# EAGLE design PX4IOv1.3 (EAGLE 6.2)
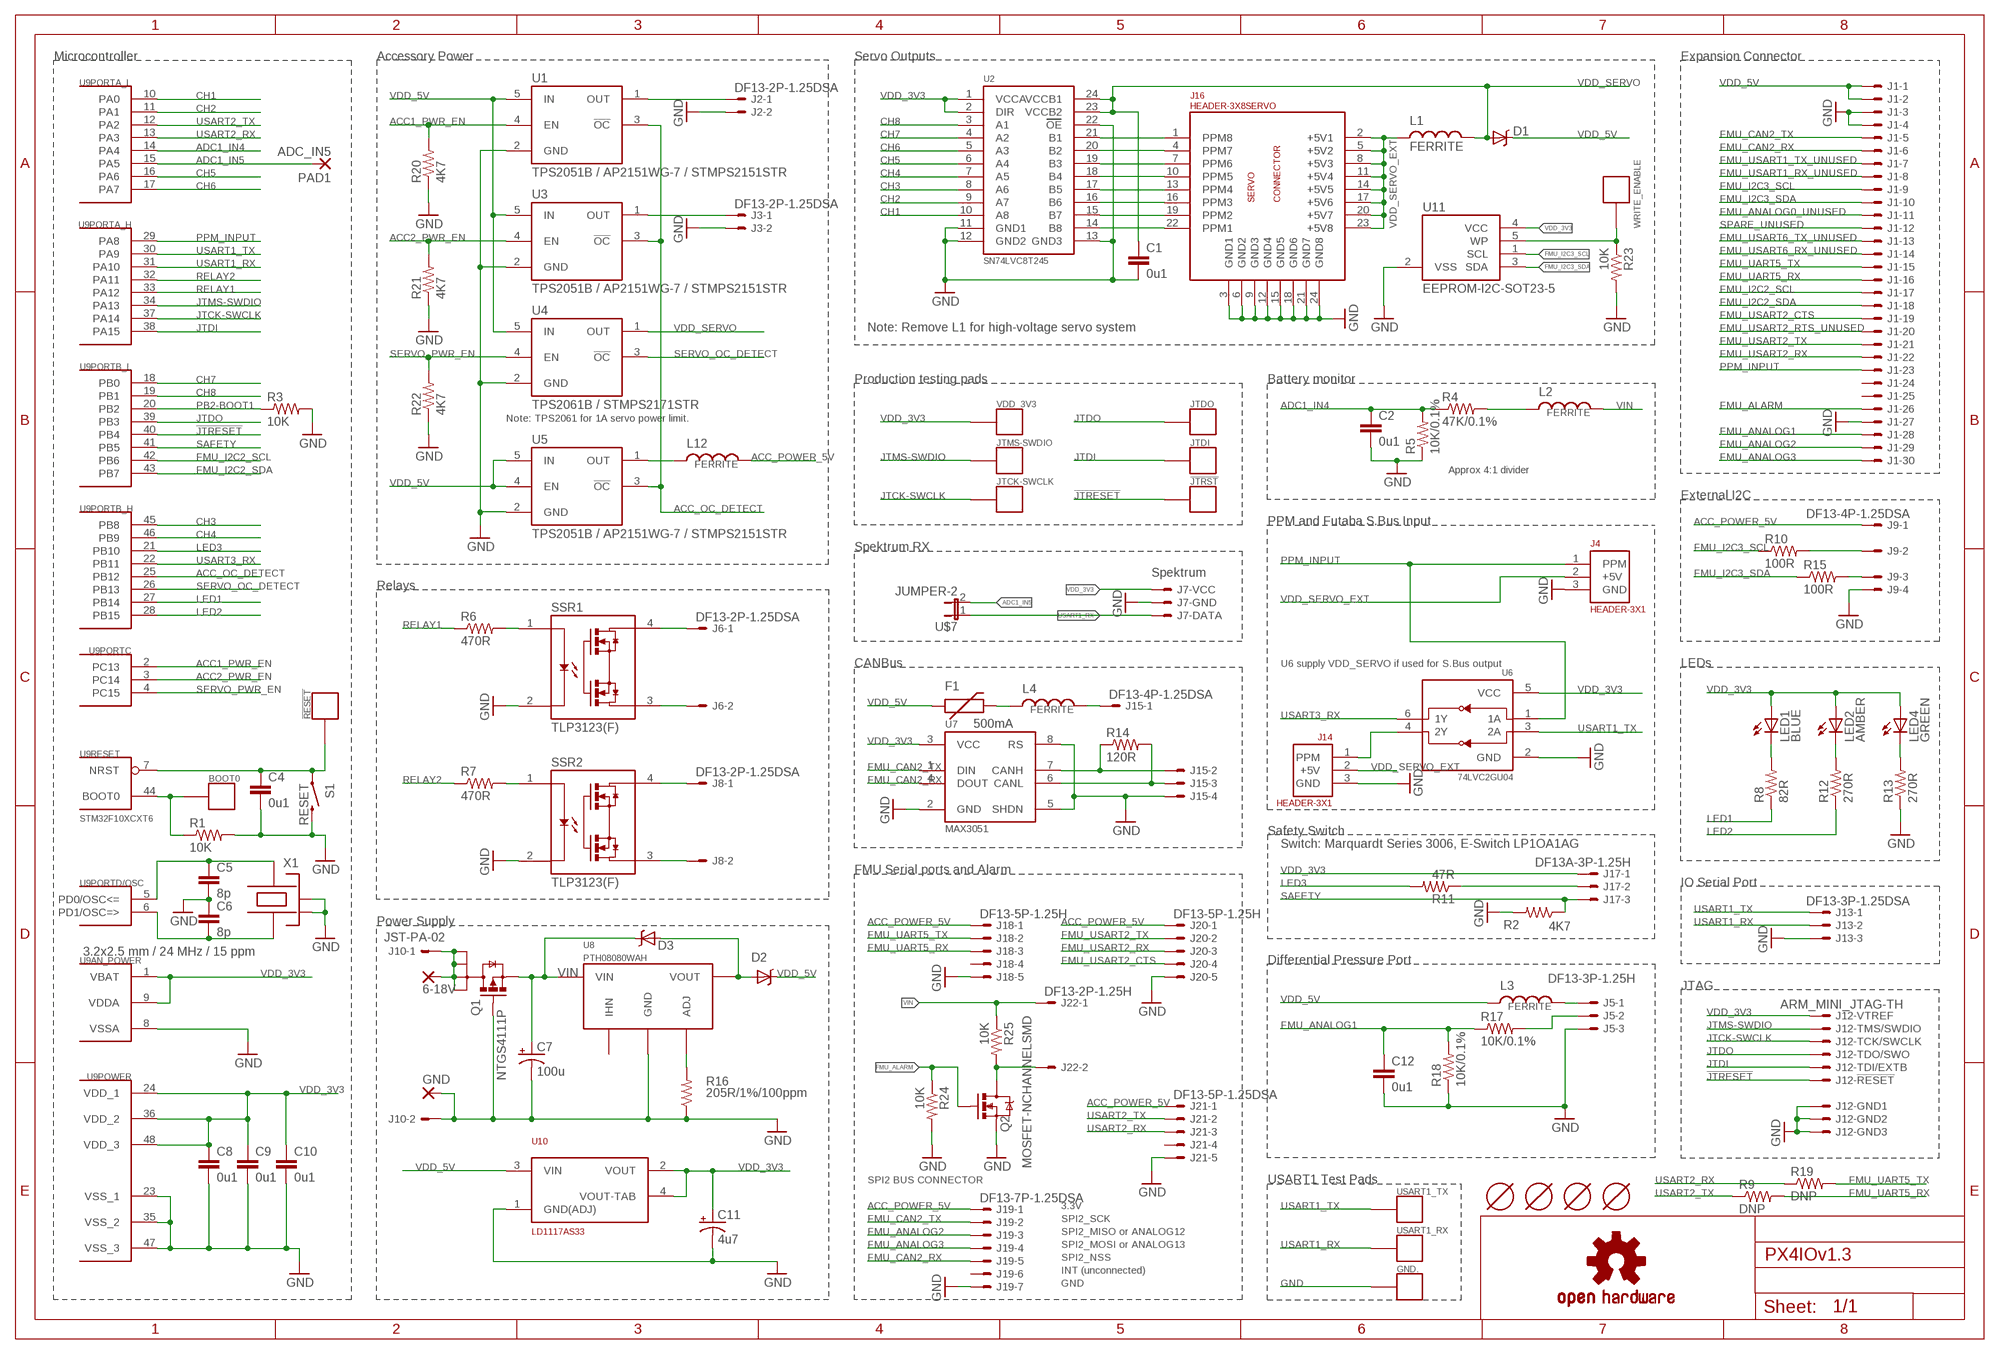
[diagram p0: schematic, sheet 1]

## Parts
6-18V  WIREPADSMD3,5-2  [3,5-2]
!JTRST  PAD.04  [PAD.04X.04]
!RESET  PAD.03  [PAD.03X.03]
BOOT0  PAD.04  [PAD.04X.04]
C1  0u1  CAP0402-CAP  [0402-CAP]
C2  0u1  CAP0402-CAP  [0402-CAP]
C4  0u1  CAP0402-CAP  [0402-CAP]
C5  8p  CAP0402-CAP  [0402-CAP]
C6  8p  CAP0402-CAP  [0402-CAP]
C7  100u  CAP_POL7343  [EIA7343]
C8  0u1  CAP0402-CAP  [0402-CAP]
C9  0u1  CAP0402-CAP  [0402-CAP]
C10  0u1  CAP0402-CAP  [0402-CAP]
C11  4u7  CAP_POL1206  [EIA3216]
C12  0u1  CAP0402-CAP  [0402-CAP]
D1  BAT 60A E6327  DIODE-SCHOTTKY_MSMP  [MICROSMP]
D2  BAT 60A E6327  DIODE-SCHOTTKY_MSMP  [MICROSMP]
D3  MSS1P4-M3/89A  DIODE-SCHOTTKY_MSMP  [MICROSMP]
F1  500mA  PTC0603  [0603]
GND  WIREPADSMD3,5-2  [3,5-2]
GND.  PAD.04  [PAD.04X.04]
J1  HEADER_2X15-REV  [HEADER_2MM_2X15_REVERSE]
J2  DF13-2P-1.25DSA  [DF13-2P-1.25DSA]
J3  DF13-2P-1.25DSA  [DF13-2P-1.25DSA]
J4  HEADER-3X1  HEADER-3X1RA  [3X1RA]
J5  DF13-3P-1.25H  [DF13A-3P-1.25H]
J6  DF13-2P-1.25DSA  [DF13-2P-1.25DSA]
J7  CONN_SPEKTRUM_RX-TH  [B3B-ZR]
J8  DF13-2P-1.25DSA  [DF13-2P-1.25DSA]
J9  DF13-4P-1.25DSA  [DF13-4P-1.25DSA]
J10  JST-PA-02  [S02B-PASK-2]
J12  ARM_MINI_JTAG-TH  [FTSH-105-01-XXX-DV]
J13  DF13-3P-1.25DSA  [DF13-3P-1.25DSA]
J14  HEADER-3X1  HEADER-3X1RA  [3X1RA]
J15  DF13-4P-1.25DSA  [DF13-4P-1.25DSA]
J16  HEADER-3X8SERVO  [3X8RA]
J17  DF13A-3P-1.25H  DF13-3P-1.25H  [DF13A-3P-1.25H]
J18  DF13-5P-1.25H  [DF13A-5P-1.25H]
J19  DF13-7P-1.25DSA  [DF13-7P-1.25DSA]
J20  DF13-5P-1.25H  [DF13A-5P-1.25H]
J21  DF13-5P-1.25DSA  [DF13-5P-1.25DSA]
J22  DF13-2P-1.25H  [DF13A-2P-1.25H]
JTCK-SWCLK  PAD.04  [PAD.04X.04]
JTDI  PAD.04  [PAD.04X.04]
JTDO  PAD.04  [PAD.04X.04]
JTMS-SWDIO  PAD.04  [PAD.04X.04]
L1  FERRITE  INDUCTOR0402  [0402-IND]
L2  FERRITE  INDUCTOR0402  [0402-IND]
L3  FERRITE  INDUCTOR0402  [0402-IND]
L4  FERRITE  INDUCTOR0402  [0402-IND]
L12  FERRITE  INDUCTOR0402  [0402-IND]
LED1  BLUE  LED0603  [LED-0603]
LED2  AMBER  LED0603  [LED-0603]
LED4  GREEN  LED0603  [LED-0603]
PAD1  ADC_IN5  WIREPADSMD2.5-1.8  [PAD-2.5-1.8]
Q1  NTGS4111P  [TSOP-6]
Q2  MOSFET-NCHANNELSMD  [SOT23-3]
R1  10K  RESISTOR0402-RES  [0402-RES]
R2  4K7  RESISTOR0402-RES  [0402-RES]
R3  10K  RESISTOR0402-RES  [0402-RES]
R4  47K/0.1%  RESISTOR0402-RES  [0402-RES]
R5  10K/0.1%  RESISTOR0402-RES  [0402-RES]
R6  470R  RESISTOR0402-RES  [0402-RES]
R7  470R  RESISTOR0402-RES  [0402-RES]
R8  82R  RESISTOR0402-RES  [0402-RES]
R9  DNP  RESISTOR0402-RES  [0402-RES]
R10  100R  RESISTOR0402-RES  [0402-RES]
R11  47R  RESISTOR0402-RES  [0402-RES]
R12  270R  RESISTOR0402-RES  [0402-RES]
R13  270R  RESISTOR0402-RES  [0402-RES]
R14  120R  RESISTOR0402-RES  [0402-RES]
R15  100R  RESISTOR0402-RES  [0402-RES]
R16  205R/1%/100ppm  RESISTOR0402-RES  [0402-RES]
R17  10K/0.1%  RESISTOR0402-RES  [0402-RES]
R18  10K/0.1%  RESISTOR0402-RES  [0402-RES]
R19  DNP  RESISTOR0402-RES  [0402-RES]
R20  4K7  RESISTOR0402-RES  [0402-RES]
R21  4K7  RESISTOR0402-RES  [0402-RES]
R22  4K7  RESISTOR0402-RES  [0402-RES]
R23  10K  RESISTOR0402-RES  [0402-RES]
R24  10K  RESISTOR0402-RES  [0402-RES]
R25  10K  RESISTOR0402-RES  [0402-RES]
S1  RESET  SWITCH-MOMENTARY-2  [EVQP7J01K]
SSR1  TLP3123(F)  TLP3123SO  [SOP4-2.54]
SSR2  TLP3123(F)  TLP3123SO  [SOP4-2.54]
U1  TPS2051B / AP2151WG-7 / STMPS2151STR  TPS2051B  [SOT23-5L]
U2  SN74LVC8T245  [R-PDSO-G24]
U3  TPS2051B / AP2151WG-7 / STMPS2151STR  TPS2051B  [SOT23-5L]
U4  TPS2061B / STMPS2171STR  TPS2051B  [SOT23-5L]
U5  TPS2051B / AP2151WG-7 / STMPS2151STR  TPS2051B  [SOT23-5L]
U6  74LVC2GU04  [SOT363_PHILIPS]
U7  MAX3051  [SO08]
U8  PTH08080WAH  [PTH08080W_TH]
U9  STM32F10XCXT6  [TQFP48]
U10  LD1117AS33  [SOT-223]
U11  EEPROM-I2C-SOT23-5  [SOT23-5]
U$1  OSHW-LOGOS  [OSHW-LOGO-S]
U$2  MOUNT-HOLE3.1MM  [MOUNT-HOLE3.1]
U$3  MOUNT-HOLE3.1MM  [MOUNT-HOLE3.1]
U$4  MOUNT-HOLE3.1MM  [MOUNT-HOLE3.1]
U$5  MOUNT-HOLE3.1MM  [MOUNT-HOLE3.1]
U$7  JUMPER-2  [SJ_2]
USART1_RX  PAD.04  [PAD.04X.04]
USART1_TX  PAD.04  [PAD.04X.04]
VDD_3V3  PAD.04  [PAD.04X.04]
WRITE_ENABLE  PAD.04  [PAD.04X.04]
X1  3.2x2.5 mm / 24 MHz / 15 ppm  OSCILLATOR-3.2X2.5  [OSCILLATOR-3.2X2.5]

## Nets
!JTRESET: !JTRST.P$1 J12.10 U9.40(PORTB_L:PB4)
ACC1_PWR_EN: R20.2 U1.4(EN) U9.2(PORTC:PC13)
ACC2_PWR_EN: R21.2 U3.4(EN) U9.3(PORTC:PC14)
ACC_OC_DETECT: U1.3(!OC) U3.3(!OC) U5.3(!OC) U9.25(PORTB_H:PB12)
ACC_POWER_5V [power]: J9.1 J18.1 J19.1 J20.1 J21.1 L12.2
ADC1_IN4: C2.1 R4.1 R5.2 U9.14(PORTA_L:PA4)
ADC1_IN5: PAD1.P$1(P) U9.15(PORTA_L:PA5) U$7.2
BOOT0: BOOT0.P$1 R1.1 U9.44(RESET:BOOT0)
CH1: U2.10(A8) U9.10(PORTA_L:PA0)
CH2: U2.9(A7) U9.11(PORTA_L:PA1)
CH3: U2.8(A6) U9.45(PORTB_H:PB8)
CH4: U2.7(A5) U9.46(PORTB_H:PB9)
CH5: U2.6(A4) U9.16(PORTA_L:PA6)
CH6: U2.5(A3) U9.17(PORTA_L:PA7)
CH7: U2.4(A2) U9.18(PORTB_L:PB0)
CH8: U2.3(A1) U9.19(PORTB_L:PB1)
FMU_ALARM: J1.26 Q2.1(G) R24.1
FMU_ANALOG0_UNUSED: J1.11
FMU_ANALOG1: C12.1 J1.28 R17.1 R18.2
FMU_ANALOG2: J1.29 J19.3
FMU_ANALOG3: J1.30 J19.4
FMU_CAN2_RX: J1.6 J19.5 U7.4(DOUT)
FMU_CAN2_TX: J1.5 J19.2 U7.1(DIN)
FMU_I2C2_SCL: J1.17 U9.42(PORTB_L:PB6)
FMU_I2C2_SDA: J1.18 U9.43(PORTB_L:PB7)
FMU_I2C3_SCL: J1.9 R10.1 U11.1(SCL)
FMU_I2C3_SDA: J1.10 R15.1 U11.3(SDA)
FMU_UART5_RX: J1.16 J18.3 R9.2
FMU_UART5_TX: J1.15 J18.2 R19.2
FMU_USART1_RX_UNUSED: J1.8
FMU_USART1_TX_UNUSED: J1.7
FMU_USART2_CTS: J1.19 J20.4
FMU_USART2_RTS_UNUSED: J1.20
FMU_USART2_RX: J1.22 J20.3
FMU_USART2_TX: J1.21 J20.2
FMU_USART6_RX_UNUSED: J1.14
FMU_USART6_TX_UNUSED: J1.13
GND [power]: C1.2 C2.2 C4.2 C5.2 C6.1 C7.C(-) C8.2 C9.2 C10.2 C11.C(-) C12.2 GND.1(P) GND..P$1 J1.3 J1.4 J1.27 J2.2 J3.2 J4.3(GND) J5.3 J7.2 J9.4 J10.2 J12.3 J12.5 J12.9 J13.3 J14.3(GND) J15.4 J16.3(GND1) J16.6(GND2) J16.9(GND3) J16.12(GND4) J16.15(GND5) J16.18(GND6) J16.21(GND7) J16.24(GND8) J18.5 J19.7 J20.5 J21.5 Q1.3(G) Q2.2(S) R1.2 R2.2 R3.2 R5.1 R13.1 R16.1 R18.1 R20.1 R21.1 R22.1 R23.2 R24.2 S1.B3 SSR1.2 SSR2.2 U1.2(GND) U2.11(GND1) U2.12(GND2) U2.13(GND3) U2.22(OE) U3.2(GND) U4.2(GND) U5.2(GND) U6.2(GND) U7.2(GND) U7.5(SHDN) U7.8(RS) U8.2(GND) U9.8(AN_POWER:VSSA) U9.23(POWER:VSS_1) U9.35(POWER:VSS_2) U9.47(POWER:VSS_3) U10.1(GND(ADJ)) U11.2(VSS) X1.2(NC_2) X1.4(NC_4)
JTCK-SWCLK: J12.4 JTCK-SWCLK.P$1 U9.37(PORTA_H:PA14)
JTDI: J12.8 JTDI.P$1 U9.38(PORTA_H:PA15)
JTDO: J12.6 JTDO.P$1 U9.39(PORTB_L:PB3)
JTMS-SWDIO: J12.2 JTMS-SWDIO.P$1 U9.34(PORTA_H:PA13)
LED1: R8.1 U9.27(PORTB_H:PB14)
LED2: R12.1 U9.28(PORTB_H:PB15)
LED3: R11.2 U9.21(PORTB_H:PB10)
N$1: R7.2 SSR2.1
N$2: R6.2 SSR1.1
N$3: J14.1(PPM) U6.4(2Y)
N$4 [power]: L12.1 U5.1(OUT)
N$5: C6.2 U9.6(PORTD/OSC:PD1/OSC=>) X1.1
N$6: C5.1 U9.5(PORTD/OSC:PD0/OSC<=) X1.3
N$7: L2.1 R4.2
N$8: LED1.C R8.2
N$9: R16.2 U8.4(ADJ)
N$10: J17.2 R11.1
N$11: R23.1 U11.5(WP) WRITE_ENABLE.P$1
N$12: J22.2 Q2.3(D) R25.2
N$14: F1.2 L4.1
N$15: J5.2 R17.2
N$21 [power]: J8.1 SSR2.4
N$22 [power]: J8.2 SSR2.3
N$23 [power]: J6.2 SSR1.3
N$24 [power]: J6.1 SSR1.4
N$27: J9.3 R15.2
N$28: J9.2 R10.2
N$29 [power]: J2.1 U1.1(OUT)
N$30 [power]: J3.1 U3.1(OUT)
N$31: LED2.C R12.2
N$38: LED4.C R13.2
N$43: J15.2 R14.1 U7.7(CANH)
N$44: J15.3 R14.2 U7.6(CANL)
N$47 [power]: J15.1 L4.2
NRST: !RESET.P$1 C4.1 S1.A1 U9.7(RESET:NRST)
PB2-BOOT1: R3.1 U9.20(PORTB_L:PB2)
PPM1: J16.22(PPM1) U2.14(B8)
PPM2: J16.19(PPM2) U2.15(B7)
PPM3: J16.16(PPM3) U2.16(B6)
PPM4: J16.13(PPM4) U2.17(B5)
PPM5: J16.10(PPM5) U2.18(B4)
PPM6: J16.7(PPM6) U2.19(B3)
PPM7: J16.4(PPM7) U2.20(B2)
PPM8: J16.1(PPM8) U2.21(B1)
PPM_INPUT: J1.23 J4.1(PPM) U6.1(1A) U9.29(PORTA_H:PA8)
RELAY1: R6.1 U9.33(PORTA_H:PA12)
RELAY2: R7.1 U9.32(PORTA_H:PA11)
SAFETY: J17.3 R2.1 U9.41(PORTB_L:PB5)
SERVO_OC_DETECT: U4.3(!OC) U9.26(PORTB_H:PB13)
SERVO_PWR_EN: R22.2 U4.4(EN) U9.4(PORTC:PC15)
SPARE_UNUSED: J1.12
USART1_RX: J7.1 J13.2 U9.31(PORTA_H:PA10) U$7.1 USART1_RX.P$1
USART1_TX: J13.1 U6.3(2A) U9.30(PORTA_H:PA9) USART1_TX.P$1
USART2_RX: J21.3 R19.1 U9.13(PORTA_L:PA3)
USART2_TX: J21.2 R9.1 U9.12(PORTA_L:PA2)
USART3_RX: U6.6(1Y) U9.22(PORTB_H:PB11)
VDD_3V3 [power]: C8.1 C9.1 C10.1 C11.A(+) J7.3 J12.1 J17.1 LED1.A LED2.A LED4.A U2.1(VCCA) U2.2(DIR) U6.5(VCC) U7.3(VCC) U9.1(AN_POWER:VBAT) U9.9(AN_POWER:VDDA) U9.24(POWER:VDD_1) U9.36(POWER:VDD_2) U9.48(POWER:VDD_3) U10.2(VOUT) U10.4(VOUT-TAB) U11.4(VCC) VDD_3V3.P$1
VDD_5V [power]: D1.CATHODE(C) D2.CATHODE(C) F1.1 J1.1 J1.2 L3.1 U1.5(IN) U3.5(IN) U4.5(IN) U5.4(EN) U5.5(IN) U10.3(VIN)
VDD_5V_ANALOG [power]: J5.1 L3.2
VDD_SERVO [power]: C1.1 D1.ANODE(A) L1.2 U2.23(VCCB2) U2.24(VCCB1) U4.1(OUT)
VDD_SERVO_EXT [power]: J4.2(+5V) J14.2(+5V) J16.2(+5V1) J16.5(+5V2) J16.8(+5V3) J16.11(+5V4) J16.14(+5V5) J16.17(+5V6) J16.20(+5V7) J16.23(+5V8) L1.1
VIN [power]: C7.A(+) D3.CATHODE(C) J22.1 L2.2 Q1.4(S) R25.1 U8.1(VIN)
VIN_CONTACT [power]: 6-18V.1(P) J10.1 Q1.1(D) Q1.2(D1) Q1.5(D2) Q1.6(D3)
VOUT: D2.ANODE(A) D3.ANODE(A) U8.3(VOUT)
Unconnected: J1.24 J1.25 J18.4 J19.6 J21.4 U8.5(IHN)

## Notes on the sheet
- Microcontroller | Accessory Power | Servo Outputs | Expansion Connector
- Note: Remove L1 for high-voltage servo system
- Production testing pads | Battery monitor
- Note: TPS2061 for 1A servo power limit.
- Approx 4:1 divider
- External I2C
- PPM and Futaba S.Bus Input
- Spektrum RX
- Spektrum
- Relays
- CANBus | U6 supply VDD_SERVO if used for S.Bus output | LEDs
- Safety Switch
- Switch: Marquardt Series 3006, E-Switch LP1OA1AG
- FMU Serial ports and Alarm
- IO Serial Port
- Power Supply
- Differential Pressure Port
- JTAG
- SPI2 BUS CONNECTOR | USART1 Test Pads
- 3.3V
- SPI2_SCK
- SPI2_MISO or ANALOG12
- SPI2_MOSI or ANALOG13
- SPI2_NSS
- INT (unconnected)
- GND

## Library data of the parts
6-18V GND = pixhawk2:WIREPAD: Wire PAD connect wire on PCB; BOM: EXCLUDE; PARTNO: *
!JTRST !RESET BOOT0 GND. JTCK-SWCLK JTDI JTDO JTMS-SWDIO USART1_RX USART1_TX VDD_3V3 WRITE_ENABLE = pixhawk2:PAD: Test pad This footprint includes three classes: The actual test pads, a pogo-pin footprint to mount the pogo-pin as through-hole part and a hole footprint which allows the head of the pogo-pin to pass through (do NOT use the hole to mount the pogo-pin). In a typical test setup, the stack would consist of three PCBs: The actual PCB under testing with a test pad on the bottom, then a second PCB with the hole for the pogo-pin head where the PCB under testing is pressed on and a third PCB at 30 mm / 1.2" distance with the pogo-pin footprints. The pogo-pins are soldered to the last PCB. To create the stack, copy the board under testing and exchange the footprints - this way the correct positioning is ensured.; BOM: EXCLUDE; PARTNO: *
C1 C2 C4 C8-C10 C12 = pixhawk2:CAP: Capacitor Standard 0603 ceramic capacitor, and 0.1" leaded capacitor.; PARTNO: CC0402ZRY5V7BB104
C5 C6 = pixhawk2:CAP: Capacitor Standard 0603 ceramic capacitor, and 0.1" leaded capacitor.; PARTNO: C1005C0G1H080C
C7 = pixhawk2:CAP_POL: Capacitor Polarized These are standard SMD and PTH capacitors. Normally 10uF, 47uF, and 100uF in electrolytic and tantalum varieties. Always verify the external diameter of the through hole cap, it varies with capacity, voltage, and manufacturer. The EIA devices should be standard.; PARTNO: T491X107K025ZT
C11 = pixhawk2:CAP_POL: Capacitor Polarized These are standard SMD and PTH capacitors. Normally 10uF, 47uF, and 100uF in electrolytic and tantalum varieties. Always verify the external diameter of the through hole cap, it varies with capacity, voltage, and manufacturer. The EIA devices should be standard.; PARTNO: T491A475K010AT
D1 D2 = pixhawk2:DIODE-SCHOTTKY: Schottky barrier diode in DO214AC, e.g. Fairchild SS14.; PARTNO: BAT 60A E6327
D3 = pixhawk2:DIODE-SCHOTTKY: Schottky barrier diode in DO214AC, e.g. Fairchild SS14.; PARTNO: MSS1P4-M3/89A
F1 = pixhawk2:PTC: Resettable Fuse PTC Resettable Fuse. Spark Fun Electronics SKU : COM-08357; PARTNO: MF-FSMF050X-2
J1 = pixhawk2:HEADER_2X15: 2X15 header; PARTNO: 951230-2520-AR-PR
J2 J3 J6 J8 = pixhawk2:DF13-2P-1.25?; PARTNO: DF13-2P-1.25DSA
J4 J14 = pixhawk2:HEADER-3X1: Single row 0.1" servo header; BOM: EXCLUDE; PARTNO: 53047-02
J5 = pixhawk2:DF13-3P-1.25?; PARTNO: DF13-3P-1.25H(20)
J7 = pixhawk2:CONN_SPEKTRUM_RX: Spektrum RX connector; JST ZH series S3B-ZR-SM4A-TF; PARTNO: B3B-ZR
J9 J15 = pixhawk2:DF13-4P-1.25?; PARTNO: DF13-4P-1.25DSA
J10 = pixhawk2:JST-PA-02: JST PA Series http://www.jst-mfg.com/product/pdf/eng/ePA-F.pdf; PARTNO: S02B-PASK-2
J12 = pixhawk2:ARM_MINI_JTAG: CONNECTOR wire to board 1.25 mm (.049 inch) pitch header; PARTNO: M50-3900542
J13 = pixhawk2:DF13-3P-1.25?; PARTNO: DF13-3P-1.25DSA
J16 = pixhawk2:HEADER-3X8; BOM: EXCLUDE; PARTNO: *
J17 = pixhawk2:DF13-3P-1.25?; PARTNO: DF13A-3P-1.25H(20)
J18 J20 = pixhawk2:DF13-5P-1.25?; PARTNO: DF13A-5P-1.25H(20)
J19 = pixhawk2:DF13-7P-1.25?; PARTNO: DF13-7P-1.25DSA(20)
J21 = pixhawk2:DF13-5P-1.25?; PARTNO: DF13-5P-1.25DSA(20)
J22 = pixhawk2:DF13-2P-1.25?; PARTNO: DF13-2P-1.25H(20)
L1-L4 L12 = pixhawk2:INDUCTOR: Inductors Basic Inductor/Choke - 0603 and 1206. Footprints are not proven and vary greatly between part numbers.; PARTNO: BKP1005HS121-T
LED1 = pixhawk2:LED: LEDs Standard schematic elements and footprints for 5mm, 3mm, 1206, and 0603 sized LEDs. 5mm - Spark Fun Electronics SKU : COM-00529 (and others); PARTNO: LNJ937W8CRA
LED2 = pixhawk2:LED: LEDs Standard schematic elements and footprints for 5mm, 3mm, 1206, and 0603 sized LEDs. 5mm - Spark Fun Electronics SKU : COM-00529 (and others); PARTNO: LNJ437W84RA
LED4 = pixhawk2:LED: LEDs Standard schematic elements and footprints for 5mm, 3mm, 1206, and 0603 sized LEDs. 5mm - Spark Fun Electronics SKU : COM-00529 (and others); PARTNO: LNJ337W83RA
PAD1 = pixhawk2:WIREPAD: Wire PAD connect wire on PCB; BOM: EXCLUDE
Q1 = pixhawk2:NTGS4111P; PARTNO: NTGS4111P
Q2 = pixhawk2:MOSFET-NCHANNEL; PARTNO: ZXMS6004FFTA
R1 R3 R5 R17 R18 R23-R25 = pixhawk2:RESISTOR: Resistor Basic schematic elements and footprints for 0603, 1206, and PTH 1/10th watt (small) resistors.; PARTNO: RMCF0402FT10K0
R2 R20-R22 = pixhawk2:RESISTOR: Resistor Basic schematic elements and footprints for 0603, 1206, and PTH 1/10th watt (small) resistors.; PARTNO: RMCF0402JT4K70
R4 = pixhawk2:RESISTOR: Resistor Basic schematic elements and footprints for 0603, 1206, and PTH 1/10th watt (small) resistors.; PARTNO: RC0402FR-0747KL
R6 R7 = pixhawk2:RESISTOR: Resistor Basic schematic elements and footprints for 0603, 1206, and PTH 1/10th watt (small) resistors.; PARTNO: RMCF0402JT470R
R8 = pixhawk2:RESISTOR: Resistor Basic schematic elements and footprints for 0603, 1206, and PTH 1/10th watt (small) resistors.; PARTNO: MCR01MZPJ820
R9 R19 = pixhawk2:RESISTOR: Resistor Basic schematic elements and footprints for 0603, 1206, and PTH 1/10th watt (small) resistors.; BOM: EXCLUDE; PARTNO: RMCF0402FT10K0
R10 R15 = pixhawk2:RESISTOR: Resistor Basic schematic elements and footprints for 0603, 1206, and PTH 1/10th watt (small) resistors.; PARTNO: RMCF0402JT100R
R11 = pixhawk2:RESISTOR: Resistor Basic schematic elements and footprints for 0603, 1206, and PTH 1/10th watt (small) resistors.; PARTNO: RMCF0402JT47R0
R12 R13 = pixhawk2:RESISTOR: Resistor Basic schematic elements and footprints for 0603, 1206, and PTH 1/10th watt (small) resistors.; PARTNO: MCR01MZPJ271
R14 = pixhawk2:RESISTOR: Resistor Basic schematic elements and footprints for 0603, 1206, and PTH 1/10th watt (small) resistors.; PARTNO: P120JCT-ND
R16 = pixhawk2:RESISTOR: Resistor Basic schematic elements and footprints for 0603, 1206, and PTH 1/10th watt (small) resistors.; PARTNO: ERJ-2RKF2050X
S1 = pixhawk2:SWITCH-MOMENTARY-2; BOM: EXCLUDE; PARTNO: EVQP7J01K
SSR1 SSR2 = pixhawk2:TLP3123: TLP3123 Solid State Relay The TOSHIBA TLP3123 consists of a gallium arsenide infrared emitting diode optically coupled to a photo-MOS FET in a plastic SOP package. The TLP3123 is a bi-directional switch, which can replace mechanical relays in many applications. And its high on-state current maximum rating and low on-state resistance is suitable to control a power line. http://www.semicon.toshiba.co.jp/docs/datasheet/en/Opto/TLP3123_en_datasheet_071001.pdf; PARTNO: TLP3123(F)
U1 U3 U5 = pixhawk2:TPS2051B: CURRENT-LIMITED, POWER-DISTRIBUTION SWITCH The TPS204xB/TPS205xB power-distribution switches are intended for applications where heavy capacitive loads and short circuits are likely to be encountered. 500-mA continuous current, accurate Current Limit (0.75 A min, 1.25 A max), operating range: 2.7 V to 5.5 V. These devices incorporates 70-m? N-channel MOSFET power switches for power-distribution systems that require multiple power switches in a single package. Each switch is controlled by a logic enable input. Gate drive is provided by an internal charge pump designed to control the power-switch rise times and fall times to minimize current surges during switching. The charge pump requires no external components and allows operation from supplies as low as 2.7 V. http://focus.ti.com/lit/ds/symlink/tps2051b.pdf; PARTNO: AP2151WG-7
U2 = pixhawk2:SN74LVC8T245; PARTNO: SN74LVC8T245DBQR
U4 = pixhawk2:TPS2051B: CURRENT-LIMITED, POWER-DISTRIBUTION SWITCH The TPS204xB/TPS205xB power-distribution switches are intended for applications where heavy capacitive loads and short circuits are likely to be encountered. 500-mA continuous current, accurate Current Limit (0.75 A min, 1.25 A max), operating range: 2.7 V to 5.5 V. These devices incorporates 70-m? N-channel MOSFET power switches for power-distribution systems that require multiple power switches in a single package. Each switch is controlled by a logic enable input. Gate drive is provided by an internal charge pump designed to control the power-switch rise times and fall times to minimize current surges during switching. The charge pump requires no external components and allows operation from supplies as low as 2.7 V. http://focus.ti.com/lit/ds/symlink/tps2051b.pdf; PARTNO: STMPS2171STR
U6 = pixhawk2:74LVC2GU04: DUAL INVERTER GATE This dual inverter is designed for 1.65-V to 5.5-V VCC operation. The SN74LVC2GU04 contains two inverters with unbuffered outputs and performs the Boolean function Y = A. It is available from NXP and TI. http://www.nxp.com/documents/data_sheet/74LVC2GU04.pdf http://focus.ti.com/lit/ds/symlink/sn74lvc2gu04.pdf; PARTNO: 74LVC2GU04GW,125
U7 = pixhawk2:MAX3051: 3.3-V CAN TRANSCEIVER; PARTNO: MAX3051ESA+
U8 = pixhawk2:PTH08080W: 2.25-A, WIDE-INPUT ADJUSTABLE SWITCHING REGULATOR The input voltage range of the PTH08080W is from 4.5 V to 18 V, allowing operation from either a 5-V or 12-V input bus. Using state-of-the-art switched-mode power-conversion technology, the PTH08080W can step down to voltages as low as 0.9 V from a 5-V input bus, with less than 1 W of power dissipation. The output voltage can be adjusted to any voltage over the range, 0.9 V to 5.5 V, using a single external resistor. Operating features include an undervoltage lockout (UVLO), on/off inhibit, overcurrent protection, and overtemperature protection. http://focus.ti.com/lit/ds/symlink/pth08080w.pdf; PARTNO: PTH08080WAH
U9 = pixhawk2:STM32F10XCXT6: ST STM32F101/103 48pin LQFP; PARTNO: STM32F100C8T6B
U10 = pixhawk2:LD1117A: LD1117A LDO Datasheet: http://www.st.com/stonline/books/pdf/docs/7194.pdf; PARTNO: LD1117AS33
U11 = pixhawk2:EEPROM-I2C-?; PARTNO: 24LC01BT-I/OT
U$1 = pixhawk2:OSHW-LOGO: Open Source Hardware Logo This logo indicates the piece of hardware it is found on incorporates a OSHW license and/or adheres to the definition of open source hardware found here: http://freedomdefined.org/OSHW; BOM: EXCLUDE
U$2-U$5 = pixhawk2:MOUNT-HOLE; BOM: EXCLUDE; PARTNO: *
U$7 = pixhawk2:JUMPER-2; BOM: EXCLUDE
X1 = pixhawk2:OSCILLATOR: Crystal Oscillator in 3.2x2.5 SMD; PARTNO: NX3225SA-24.000000MHZ

## Net classes
0 signal: width 0.203 mm, drill 0.3 mm, clearance 0.203 mm
1 power: width 0.254 mm, drill 0.3 mm, clearance 0.203 mm

## Board
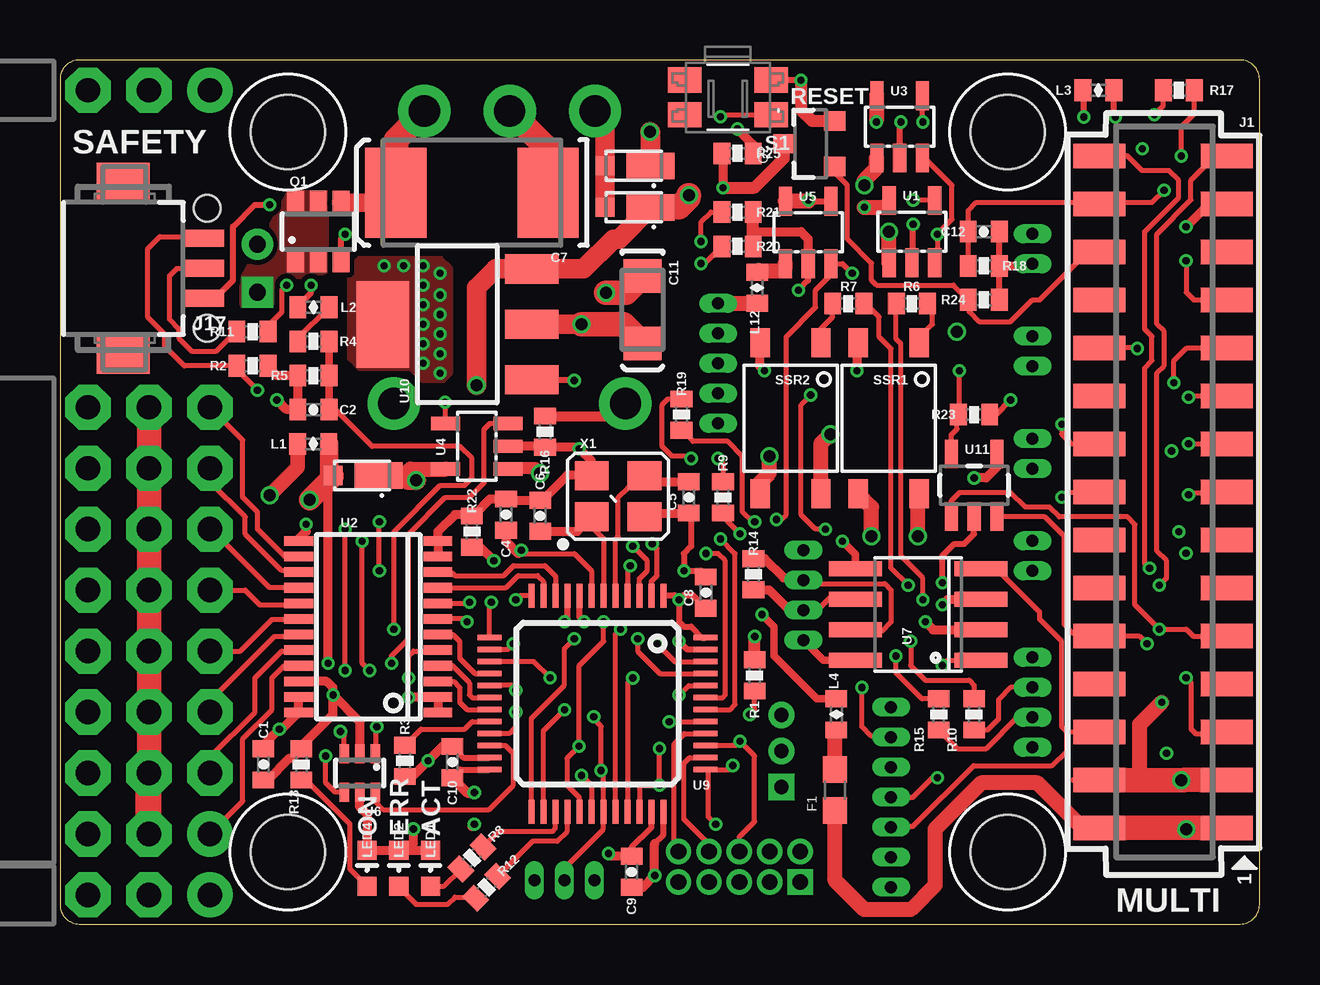
[diagram p1: board, top side]
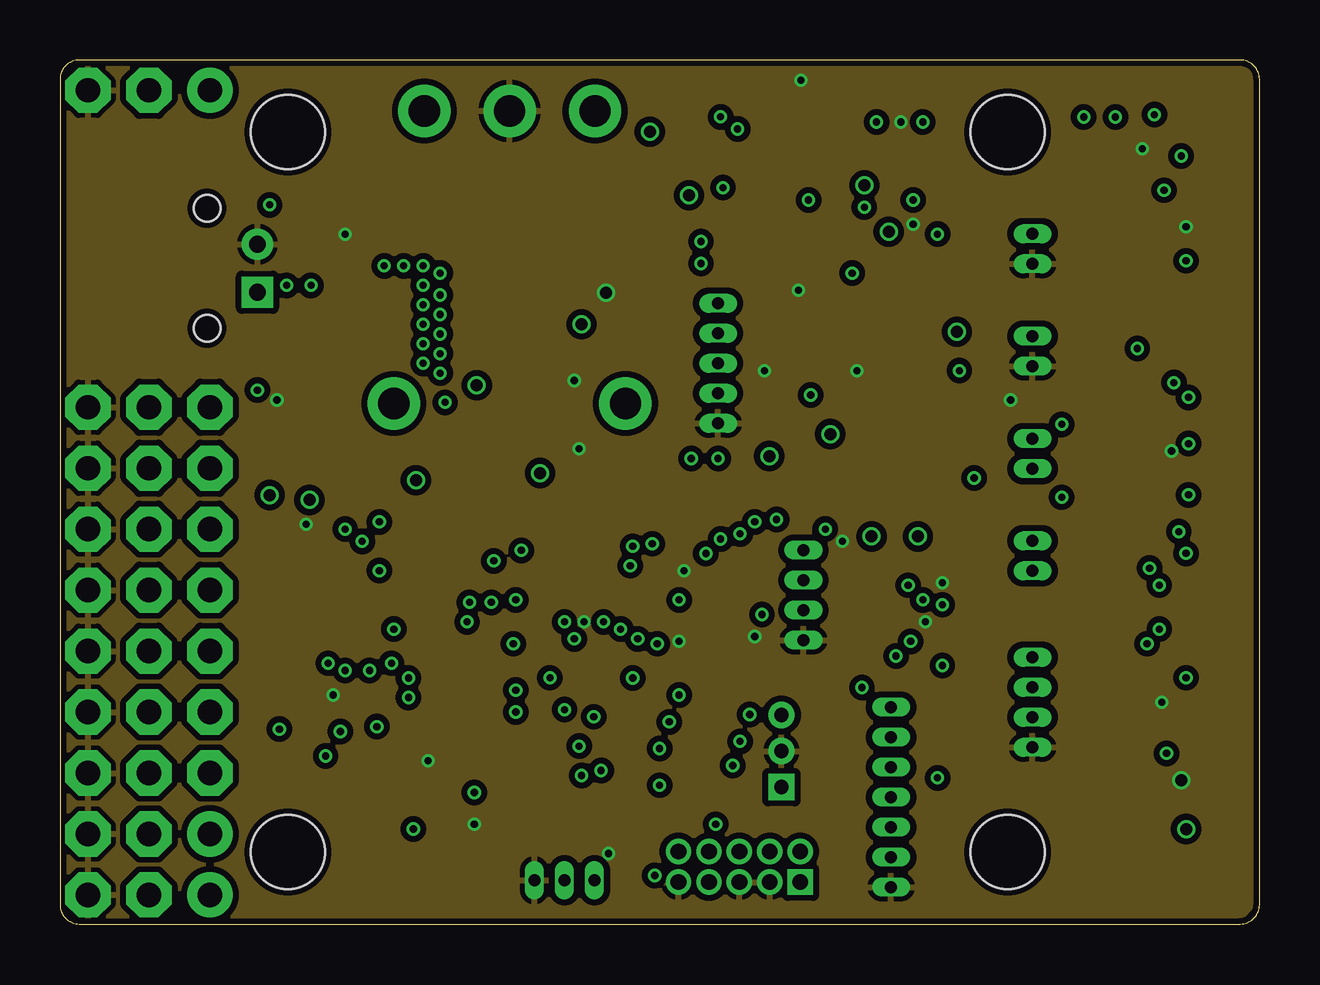
[diagram p2: board, inner layer Route2]
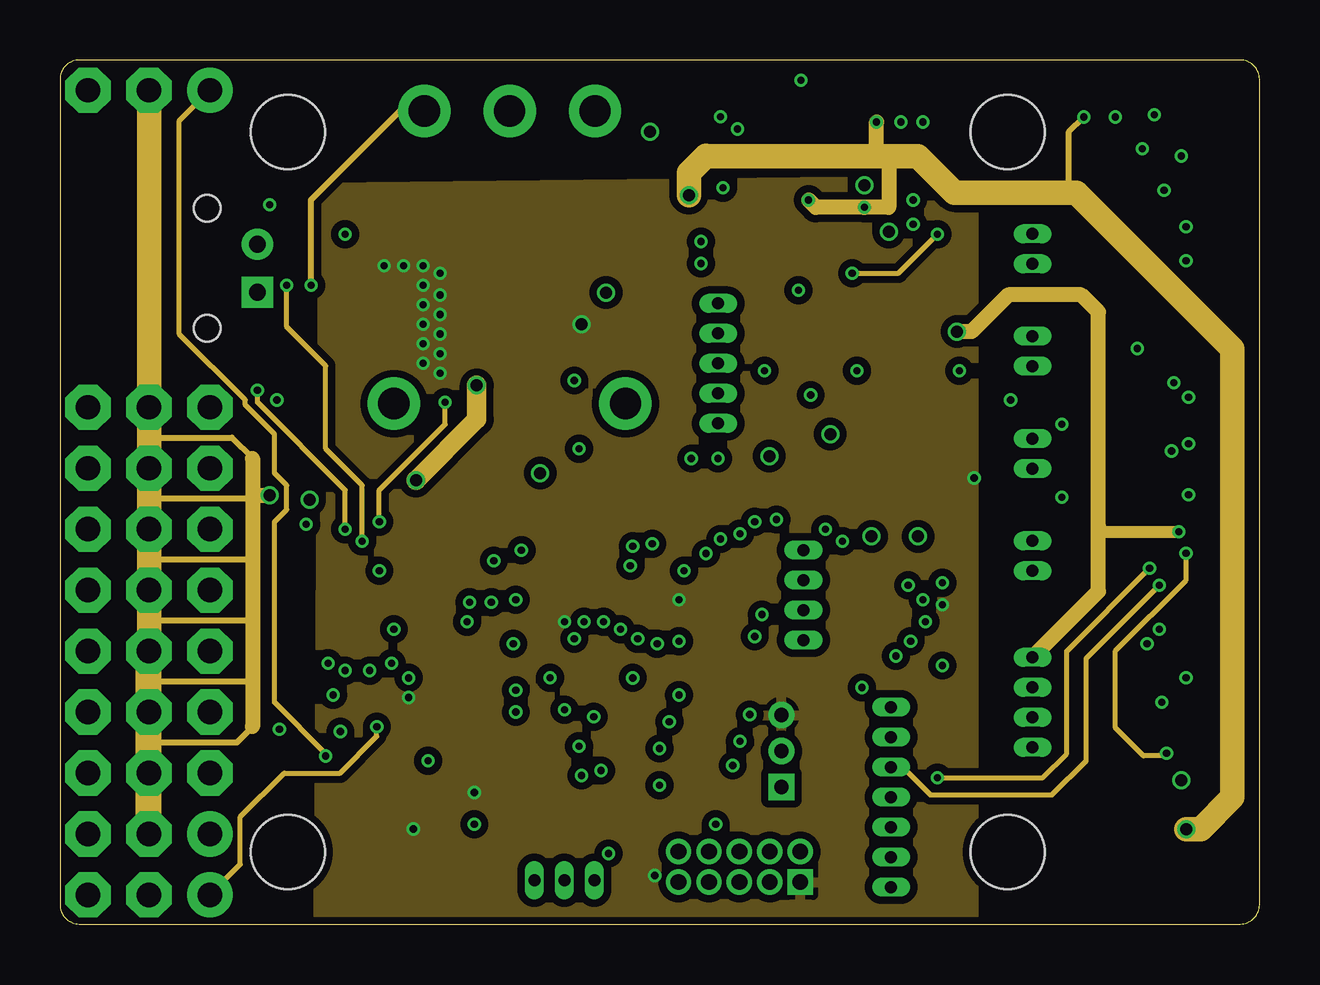
[diagram p3: board, inner layer Route15]
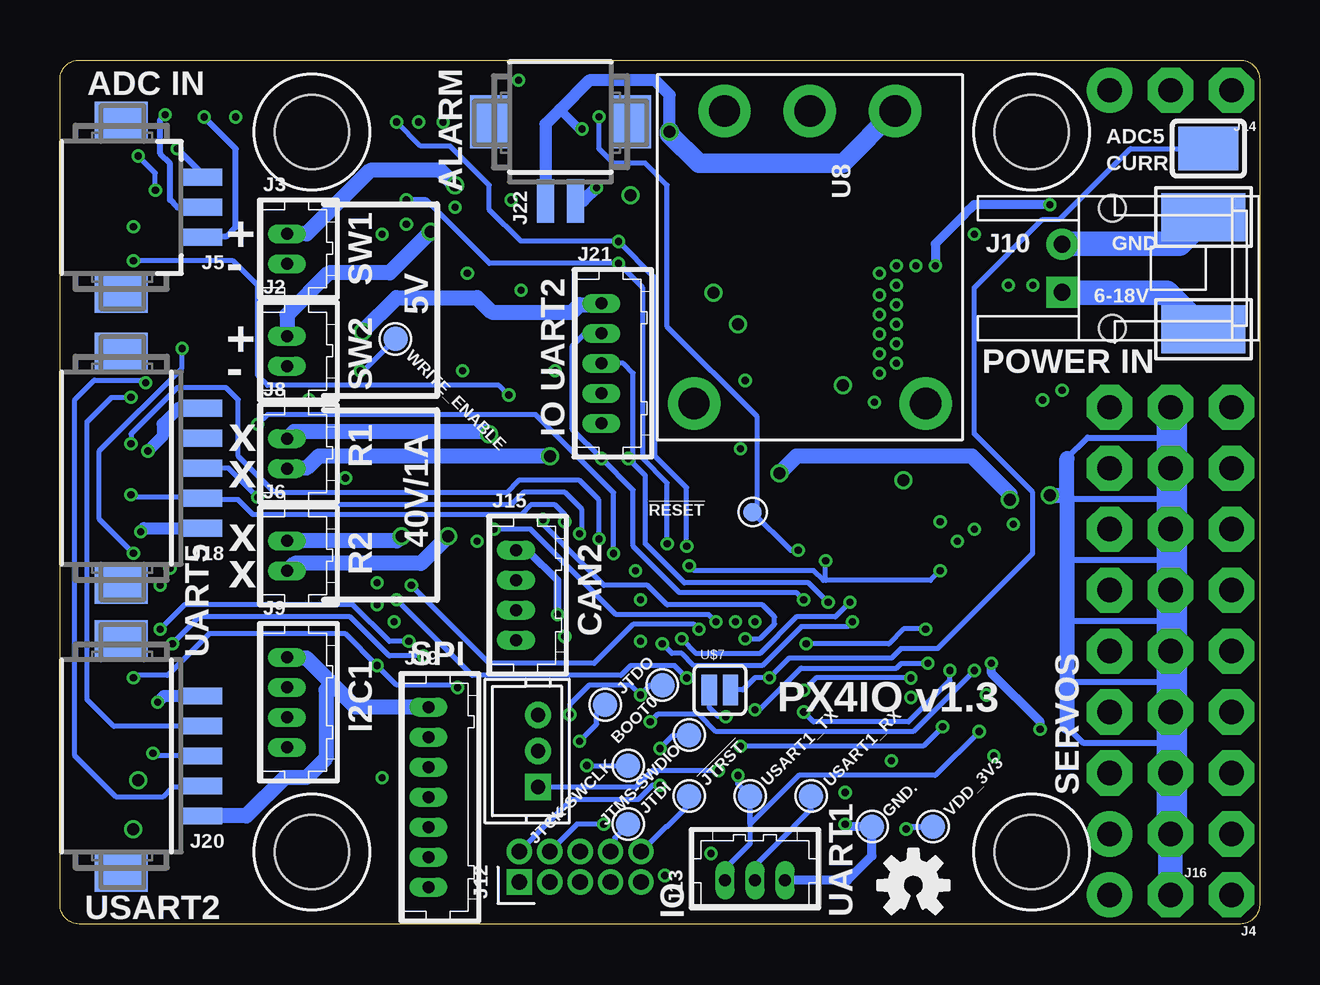
[diagram p4: board, bottom side, seen from below]

Size 50 x 36 mm. Coordinates in mm from the lower left corner, seen from the top.
Outline: 49.2,0 arc90 50,0.8 50,35.2 arc90 49.2,36 0.8,36 arc90 0,35.2 0,0.8 arc90 0.8,0 49.2,0
Copper layers (1*2*15*16): Top 0.035mm / dielectric 0.5mm / Route2 0.035mm / dielectric 0.5mm / Route15 0.035mm / dielectric 0.5mm / Bottom 0.035mm
Design rules: minimum track width 0.15mm, minimum drill 0.3mm, track to track 0.15mm, track to pad 0.15mm, pad to pad 0.15mm, via to via 0.15mm, smd to smd 0.15mm, copper to edge 0.2mm, drill to drill 0.2mm, minimum pad ring 0.125mm, minimum via ring 0.125mm, stop-mask expansion 0.075mm, vias tented up to drill 0.31mm, thermal gap 8mil

### Footprints (pad centres in the part's own frame; a part is rotated, then mirrored left to right if it is on the bottom)
3,5-2 = smd 2 x 3.5: 1 0,0
PAD.04X.04 = smd 1.016 x 1.016: P$1 0,0
PAD.03X.03 = smd 0.762 x 0.762: P$1 0,0
0402-CAP = smd 0.7 x 0.9: 1 -0.65,0; 2 0.65,0
EIA7343 = smd 2.55 x 3.75: A 3.17,0; C -3.17,0
EIA3216 = smd 1.4 x 1.6: A 1.4,0; C -1.4,0
MICROSMP = smd 0.8 x 0.8: ANODE 0.65,0 | smd 2 x 1.1: CATHODE -1.25,0
0603 = smd 1.1 x 1: 1 -0.85,0; 2 0.85,0
HEADER_2MM_2X15_REVERSE = smd 1.02 x 2.16: 1 -14,-2.655; 2 -14,2.655; 3 -12,-2.655; 4 -12,2.655; 5 -10,-2.655; 6 -10,2.655; 7 -8,-2.655; 8 -8,2.655; 9 -6,-2.655; 10 -6,2.655; 11 -4,-2.655; 12 -4,2.655; 13 -2,-2.655; 14 -2,2.655; 15 0,-2.655; 16 0,2.655; 17 2,-2.655; 18 2,2.655; 19 4,-2.655; 20 4,2.655; 21 6,-2.655; 22 6,2.655; 23 8,-2.655; 24 8,2.655; 25 10,-2.655; 26 10,2.655; 27 12,-2.655; 28 12,2.655; 29 14,-2.655; 30 14,2.655
DF13-2P-1.25DSA = drill 0.5 pad 0.8 long: 1 -0.625,0; 2 0.625,0
3X1RA = drill 1.016 pad 1.88: 1 5.08,0 | drill 1.016 pad 1.88 octagon: 2 2.54,0; 3 0,0
DF13A-3P-1.25H = smd 0.7 x 1.8: 1 -1.25,-3.3; 2 0,-3.3; 3 1.25,-3.3 | smd 1.6 x 2.2: S1 3.6,0; S2 -3.6,0
B3B-ZR = drill 0.6 pad 1.1 square: 1 -1.5,0 | drill 0.6 pad 1.1: 2 0,0; 3 1.5,0
DF13-4P-1.25DSA = drill 0.5 pad 0.8 long: 1 -1.875,0; 2 -0.625,0; 3 0.625,0; 4 1.875,0
S02B-PASK-2 = drill 0.7 pad 1.3 square: 1 1,0 | drill 0.7 pad 1.3: 2 -1,0 | hole 1.1: -2.5,2.1; 2.5,2.1
FTSH-105-01-XXX-DV = drill 0.65 pad 1.06 square: 1 0,0 | drill 0.65 pad 1.06: 2 0,1.27; 3 1.27,0; 4 1.27,1.27; 5 2.54,0; 6 2.54,1.27; 7 3.81,0; 8 3.81,1.27; 9 5.08,0; 10 5.08,1.27
DF13-3P-1.25DSA = drill 0.5 pad 0.8 long: 1 -1.25,0; 2 0,0; 3 1.25,0
3X8RA = drill 1.016 pad 1.88: 1 3.81,8.89 | drill 1.016 pad 1.88 octagon: 2 1.27,8.89; 3 -1.27,8.89; 4 3.81,6.35; 5 1.27,6.35; 6 -1.27,6.35; 7 3.81,3.81; 8 1.27,3.81; 9 -1.27,3.81; 10 3.81,1.27; 11 1.27,1.27; 12 -1.27,1.27; 13 3.81,-1.27; 14 1.27,-1.27; 15 -1.27,-1.27; 16 3.81,-3.81; 17 1.27,-3.81; 18 -1.27,-3.81; 19 3.81,-6.35; 20 1.27,-6.35; 21 -1.27,-6.35; 22 3.81,-8.89; 23 1.27,-8.89; 24 -1.27,-8.89
DF13A-5P-1.25H = smd 0.7 x 1.8: 1 -2.5,-3.3; 2 -1.25,-3.3; 3 0,-3.3; 4 1.25,-3.3; 5 2.5,-3.3 | smd 1.6 x 2.2: S1 4.85,0; S2 -4.85,0
DF13-7P-1.25DSA = drill 0.5 pad 0.8 long: 1 -3.75,0; 2 -2.5,0; 3 -1.25,0; 4 0,0; 5 1.25,0; 6 2.5,0; 7 3.75,0
DF13-5P-1.25DSA = drill 0.5 pad 0.8 long: 1 -2.5,0; 2 -1.25,0; 3 0,0; 4 1.25,0; 5 2.5,0
DF13A-2P-1.25H = smd 0.7 x 1.8: 1 -0.605,-3.3; 2 0.645,-3.3 | smd 1.6 x 2.2: S1 2.995,0; S2 -2.955,0
0402-IND = smd 0.7 x 0.9: 1 -0.65,0; 2 0.65,0
LED-0603 = smd 0.8 x 0.8: A 0,-0.75; C 0,0.75
PAD-2.5-1.8 = smd 1.8 x 2.5: P$1 0,0
TSOP-6@1 = smd 0.7 x 1: 1 -0.95,-1.2; 2 0,-1.2; 3 0.95,-1.2; 4 0.95,1.2; 5 0,1.2; 6 -0.95,1.2
SOT23-3 = smd 0.8 x 0.9: 1 -0.95,-1; 2 0.95,-1; 3 0,1.1
0402-RES = smd 0.7 x 0.9: 1 -0.65,0; 2 0.65,0
EVQP7J01K = smd 1.4 x 1.05: A1 -1.8,0.725; A2 1.8,0.725; B3 -1.8,-0.725; B4 1.8,-0.725
SOP4-2.54 = smd 0.8 x 1.2: 1 -1.27,-3.15; 2 1.27,-3.15; 3 1.27,3.15; 4 -1.27,3.15
SOT23-5L = smd 0.55 x 1.2: 1 -0.95,-1.3; 2 0,-1.3; 3 0.95,-1.3; 4 0.95,1.3; 5 -0.95,1.3
R-PDSO-G24 = smd 0.4 x 1.2: 1 -3.575,-2.9; 2 -2.925,-2.9; 3 -2.275,-2.9; 4 -1.625,-2.9; 5 -0.975,-2.9; 6 -0.325,-2.9; 7 0.325,-2.9; 8 0.975,-2.9; 9 1.625,-2.9; 10 2.275,-2.9; 11 2.925,-2.9; 12 3.575,-2.9; 13 3.575,2.9; 14 2.925,2.9; 15 2.275,2.9; 16 1.625,2.9; 17 0.975,2.9; 18 0.325,2.9; 19 -0.325,2.9; 20 -0.975,2.9; 21 -1.625,2.9; 22 -2.275,2.9; 23 -2.925,2.9; 24 -3.575,2.9
SOT363_PHILIPS = smd 0.4 x 0.8: 1 -0.65,-0.8; 2 0,-0.8; 3 0.65,-0.8; 4 0.65,0.8; 5 0,0.8; 6 -0.65,0.8
SO08 = smd 0.61 x 2.21: 1 -1.905,-2.616; 2 -0.635,-2.616; 3 0.635,-2.616; 4 1.905,-2.616; 5 1.905,2.616; 6 0.635,2.616; 7 -0.635,2.616; 8 -1.905,2.616
PTH08080W_TH = drill 1.3 pad 2.184: 1 -6.096,3.556; 2 -6.096,0; 3 -6.096,-3.556; 4 6.096,-4.826; 5 6.096,4.826
TQFP48 = smd 0.24 x 1: 1 -2.75,-4.5; 2 -2.25,-4.5; 3 -1.75,-4.5; 4 -1.25,-4.5; 5 -0.75,-4.5; 6 -0.25,-4.5; 7 0.25,-4.5; 8 0.75,-4.5; 9 1.25,-4.5; 10 1.75,-4.5; 11 2.25,-4.5; 12 2.75,-4.5; 25 2.75,4.5; 26 2.25,4.5; 27 1.75,4.5; 28 1.25,4.5; 29 0.75,4.5; 30 0.25,4.5; 31 -0.25,4.5; 32 -0.75,4.5; 33 -1.25,4.5; 34 -1.75,4.5; 35 -2.25,4.5; 36 -2.75,4.5 | smd 1 x 0.24: 13 4.5,-2.75; 14 4.5,-2.25; 15 4.5,-1.75; 16 4.5,-1.25; 17 4.5,-0.75; 18 4.5,-0.25; 19 4.5,0.25; 20 4.5,0.75; 21 4.5,1.25; 22 4.5,1.75; 23 4.5,2.25; 24 4.5,2.75; 37 -4.5,2.75; 38 -4.5,2.25; 39 -4.5,1.75; 40 -4.5,1.25; 41 -4.5,0.75; 42 -4.5,0.25; 43 -4.5,-0.25; 44 -4.5,-0.75; 45 -4.5,-1.25; 46 -4.5,-1.75; 47 -4.5,-2.25; 48 -4.5,-2.75
SOT-223 = smd 1.219 x 2.235: 1 -2.311,-3.099; 2 0,-3.099; 3 2.311,-3.099 | smd 3.6 x 2.2: 4 0,3.099
SOT23-5 = smd 0.55 x 1.2: 1 -0.95,-1.3; 2 0,-1.3; 3 0.95,-1.3; 4 0.95,1.3; 5 -0.95,1.3
MOUNT-HOLE3.1 = hole 3.1: 0,0
SJ_2 = smd 0.635 x 1.27: 1 -0.889,0; 2 0,0
OSCILLATOR-3.2X2.5 = smd 1.4 x 1.2: 1 -1.1,-0.85; 2 1.1,-0.85; 3 1.1,0.85; 4 -1.1,0.85

### Placement (x,y rotation side)
6-18V  2.34,24.78 90 bottom
!JTRST  23.77,5.33 45 bottom
!RESET  21.13,17.16 0 bottom
BOOT0  24.89,9.95 45 bottom
C1  8.48,6.65 270 top
C2  10.57,21.43 180 top
C4  18.59,17.06 90 top
C5  26.21,17.77 270 top
C6  20.02,17.01 270 top
C7  17.17,30.47 180 top
C8  26.92,13.81 90 top
C9  23.83,2.18 90 top
C10  16.36,6.75 90 top
C11  24.28,25.6 270 top
C12  38.51,28.85 0 top
D1  12.04,18.69 180 top
D2  23.37,29.86 180 top
D3  23.37,31.59 180 top
F1  32.31,5.58 90 top
GND  2.34,29.46 270 bottom
GND.  16.15,4.06 45 bottom
J1  45.97,18.01 90 top
J2  40.54,23.87 270 bottom
J3  40.54,28.14 270 bottom
J4  1.17,1.21 180 bottom
J5  47.45,29.86 90 bottom
J6  40.54,15.33 270 bottom
J7  30.07,7.21 90 bottom
J8  40.54,19.6 270 bottom
J9  40.54,9.24 270 bottom
J10  8.23,27.32 270 bottom
J12  30.86,1.74 0 bottom
J13  21.03,1.82 0 bottom
J14  1.17,34.74 180 bottom
J15  30.99,13.71 270 bottom
J16  2.44,12.64 180 bottom
J17  2.64,27.32 90 top
J18  47.45,18.99 90 bottom
J19  34.65,5.28 270 bottom
J20  47.45,7 90 bottom
J21  27.43,23.36 270 bottom
J22  29.16,33.43 0 bottom
JTCK-SWCLK  26.31,6.6 45 bottom
JTDI  26.31,4.16 45 bottom
JTDO  27.28,9.14 45 bottom
JTMS-SWDIO  23.77,7.87 180 bottom
L1  10.56,20 0 top
L2  10.57,25.7 180 top
L3  43.28,34.74 0 top
L4  32.36,8.73 90 top
L12  29.06,26.51 270 top
LED1  15.44,2.33 180 top
LED2  14.12,2.33 180 top
LED4  12.8,2.33 180 top
PAD1  2.13,32.31 90 bottom
Q1  NTGS4111P  [TSOP-6@1]  10.77,28.85 0 top
Q2  31.29,32.51 90 top
R1  28.96,10.36 90 top
R2  8.03,23.26 0 top
R3  14.38,6.8 270 top
R4  10.57,24.27 180 top
R5  10.57,22.85 0 top
R6  35.51,25.85 0 top
R7  32.86,25.85 180 top
R8  17.17,2.75 225 top
R9  27.64,17.77 270 top
R10  38.1,8.73 270 top
R11  8.03,24.68 0 top
R12  17.78,1.53 225 top
R13  10.06,6.65 270 top
R14  28.91,14.57 270 top
R15  36.63,8.73 270 top
R16  20.22,20.52 90 top
R17  46.63,34.74 180 top
R18  38.51,27.42 180 top
R19  25.91,21.23 270 top
R20  28.24,28.24 180 top
R21  28.24,29.66 180 top
R22  17.17,16.35 270 top
R23  38.1,21.23 0 top
R24  38.51,26.01 0 top
R25  28.24,32.11 180 top
S1  27.84,34.44 180 top
SSR1  34.54,21.07 180 top
SSR2  30.45,21.07 180 top
U1  35.51,28.85 0 top
U2  12.85,12.39 90 top
U3  35,33.22 0 top
U4  17.37,19.91 90 top
U5  31.19,28.82 0 top
U6  12.5,6.29 180 top
U7  35.76,12.9 90 top
U8  18.75,27.78 270 bottom
U9  22.4,9.19 180 top
U10  16.56,24.99 90 top
U11  38.1,18.28 0 top
U$1  14.43,1.62 0 bottom
U$2  39.5,33 0 top
U$3  9.5,33 0 top
U$4  39.5,3 0 top
U$5  9.5,3 0 top
U$7  22.05,9.75 0 bottom
USART1_RX  18.69,5.33 45 bottom
USART1_TX  21.23,5.33 45 bottom
VDD_3V3  13.61,4.06 45 bottom
WRITE_ENABLE  36.02,24.38 315 bottom
X1  23.27,17.82 0 top

### Tracks (layer width: path | path; a pad name or v marks a point on that pad's centre or on a via)
!JTRESET
  Top 0.203: U9.40 26.03,7.94 25.6,7.51 25.6,3.19 J12.10
  Bottom 0.203: !JTRST.P$1 23.77,4.98 24.7,4.06 24.74,4.06 J12.10
ACC1_PWR_EN  (via drill 0.3)
  Top 0.203: U1.4 36.48,30.17 v35.56,30.17 | U9.2 24.65,14.28 24.89,14.52 24.89,15.64 v24.69,15.84 | v26.72,27.52 26.88,27.52 R20.2
  Bottom 0.203: v24.69,15.84 24.69,18.38 25.7,19.4 25.7,26.51 v26.72,27.52 32.09,27.52 34.74,30.17 v35.56,30.17
ACC2_PWR_EN  (via drill 0.3)
  Top 0.203: U3.4 35.95,33.43 v35.97,33.42 | U9.3 24.15,14.39 24.49,14.72 24.49,15.13 v23.88,15.74 | v26.72,28.44 26.72,29.25 27.13,29.66 R21.2
  Bottom 0.203: v23.88,15.74 23.88,18.18 25.2,19.5 25.2,26.92 v26.72,28.44 v26.73,28.45 30.79,28.45 32.11,29.77 32.11,30.79 33.73,32.41 34.96,32.41 v35.97,33.42
ACC_OC_DETECT  (via drill 0.3)
  Top 0.203: v29.87,16.86 30.07,16.86 30.28,17.06 30.28,24.48 31.5,25.7 31.5,26.41 32.14,27.05 U5.3 32.62,27.52 v33.02,27.12 | 36.49,27.55 U1.3 36.58,27.66 v36.58,28.75 36.58,28.75 37.19,29.36 37.19,30.78 36.16,31.8 36.07,31.8 U3.3 | U9.25 19.65,8.57 20.22,9.14 21.03,9.96 21.03,11.48 21.04,11.48 v21.44,11.88
  Route15 0.203: v33.02,27.12 34.95,27.12 v36.58,28.75
  Bottom 0.203: v29.87,16.86 29.87,16.65 27.33,14.11 25.5,14.11 24.69,13.3 20.73,13.3 20.22,12.79 20.22,12.5 20.83,11.89 v21.43,11.89 v21.44,11.88
ACC_POWER_5V  (via drill 0.3, 0.5)
  Top 0.635: J21.1 L12.2 | J21.1
  Route15 0.508: v46.63,16.35 43.48,16.35 43.28,16.55
  Route15 0.635: v37.39,24.68 37.99,24.68 39.52,26.21 42.57,26.21 43.28,25.5 43.28,16.55 43.28,13.86 J9.1
  Bottom 0.508: J18.1 46.49,16.49 v46.63,16.35
  Bottom 0.635: v37.39,24.68 v37.39,24.69 35.97,26.1 32.61,26.1 32,25.49 28.66,25.49 28.35,25.81 27.49,25.81 J21.1 | J19.1 37.68,9.03 38.66,10.01 | 38.66,10.01 39.73,11.07 40.5,11.07 J9.1 | J20.1 42.23,4.5 40.64,6.1 39.73,6.1 38.91,6.91 38.91,9.75 38.66,10.01
ADC1_IN4  (via drill 0.3)
  Top 0.203: C2.1 11.48,21.43 13.01,19.91 16.66,19.91 17.17,19.4 17.17,18.59 16.87,18.28 15.85,18.28 13.92,16.35 v13.92,12.29 | U9.14 18.66,11.44 v18.9,11.68
  Top 0.305: R4.1 R5.2 C2.1
  Bottom 0.203: v13.92,12.29 14.83,12.29 15.45,11.68 v18.9,11.68
ADC1_IN5  (via drill 0.3)
  Top 0.203: U9.15 19.75,10.94 v20.42,10.26
  Bottom 0.203: PAD1.P$1 5.38,32.31 8.33,29.36 9.04,29.36 11.89,26.52 11.89,20.42 9.45,17.98 9.45,15.44 13.41,11.48 14.94,11.48 15.34,11.07 19.61,11.07 v20.42,10.26 21.03,10.26 21.54,9.75 U$7.2
BOOT0  (via drill 0.3)
  Top 0.203: U9.44 26.2,9.94 v25.81,9.54 | v28.75,8.73 28.96,8.93 R1.1
  Bottom 0.203: BOOT0.P$1 25.4,9.95 v25.81,9.54 26.21,9.95 27.94,9.95 28.75,9.14 v28.75,8.73
CH1
  Top 0.203: U9.10 20.65,14.49 20.22,14.93 18.9,14.93 18.49,14.52 16.46,14.52 16.36,14.62 15.79,14.62 U2.10
CH2
  Top 0.203: U9.11 20.15,14.28 19.91,14.52 19.1,14.52 18.59,14.01 U2.9
CH3  (via drill 0.3)
  Top 0.203: v24.08,11.88 24.08,11.37 25.01,10.44 U9.45 | v17.07,13.4 17.03,13.36 U2.8
  Bottom 0.203: v24.08,11.88 23.47,11.27 20.83,11.27 19.3,12.79 17.68,12.79 v17.07,13.4
CH4  (via drill 0.3)
  Top 0.203: U9.46 25.63,10.94 v24.89,11.68 | v16.97,12.59 16.84,12.71 U2.7
  Bottom 0.203: v16.97,12.59 17.17,12.39 19.1,12.39 20.73,10.76 23.56,10.76 24.08,11.28 24.49,11.28 v24.89,11.68
CH5
  Top 0.203: 15.83,11.98 U2.6 16.38,12.06 16.66,11.78 16.66,11.07 17.29,10.44 U9.16
CH6  (via drill 0.3)
  Top 0.203: U2.5 15.79,11.37 14.73,11.37 14.53,11.17 v14.53,10.25 | U9.17 17.91,9.95 18.8,9.95 v19,9.75
  Bottom 0.203: v14.53,10.25 18.49,10.25 v19,9.75
CH7
  Top 0.203: U9.18 17.17,9.44 17.07,9.54 17.07,10.05 16.36,10.76 U2.4
CH8
  Top 0.203: U9.19 16.96,8.94 16.66,9.24 16.66,9.85 16.4,10.11 U2.3
FMU_ALARM
  Top 0.203: J1.26 42.84,28.01 40.84,26.01 40.54,26.01 39.62,25.09 38.3,25.09 37.9,25.5 37.9,25.97 R24.1 37.25,26.62 34.04,26.62 33.83,26.82 33.83,27.53 32.82,28.55 32.82,30.79 32.29,31.31 Q2.1
FMU_ANALOG1  (via drill 0.3)
  Top 0.203: R18.2 C12.1 37.86,29.72 38.2,30.07 43.26,30.07 J1.28 43.38,30.07 45.52,30.07 v46.02,30.57 | R17.1 47.28,33.76 46.74,33.22 v46.74,32
  Bottom 0.203: v46.02,30.57 46.02,31.29 v46.74,32
FMU_ANALOG2  (via drill 0.3)
  Top 0.203: v45.82,14.11 46.13,14.42 46.13,15.13 45.72,15.54 45.72,22.96 46.02,23.27 46.02,24.69 45.72,24.99 45.72,28.75 47.14,30.17 47.14,30.98 47.95,31.79 48.41,31.79 J1.29
  Route15 0.203: v45.82,14.11 42.77,11.07 42.77,6.8 41.35,5.38 36.27,5.38 35.26,6.4 34.78,6.4 J19.3
FMU_ANALOG3  (via drill 0.3)
  Top 0.203: J1.30 44.49,32.01 45.11,31.39 46.23,31.39 46.63,30.98 46.63,30.27 45.21,28.85 45.21,24.79 45.52,24.49 45.52,23.47 45.21,23.16 45.21,15.03 v45.41,14.83 | v36.58,6.09 36.37,6.09 35.56,5.28 J19.4
  Route15 0.203: v45.41,14.83 41.96,11.37 41.96,7.1 40.95,6.09 v36.58,6.09
FMU_CAN2_RX
  Top 0.203: 41.96,8.02 41.76,8.22 41.76,11.78 40.84,12.69 40.84,13 39.22,14.62 38.56,14.62 U7.4 | 41.96,8.02 43.31,8.02 J1.6 | 41.96,8.02 41.96,7.21 41.35,6.6 38.09,6.6 35.56,4.06 34.68,4.06 J19.5
FMU_CAN2_TX  (via drill 0.3)
  Top 0.203: U7.1 37,10.99 v36.78,10.77 | v46.94,10.26 47.14,10.06 47.14,8.13 47.35,7.92 48.55,7.92 J1.5 | v33.43,9.86 33.43,8.23 33.83,7.82 34.61,7.82 J19.2
  Bottom 0.203: v46.94,10.26 46.84,10.36 45.52,10.36 43.79,12.09 38.1,12.09 v36.78,10.77 35.97,9.96 33.53,9.96 v33.43,9.86
FMU_I2C2_SCL  (via drill 0.3)
  Top 0.203: U9.42 27.94,8.94 28.14,9.14 28.14,15.44 v27.53,16.05 | v47.04,20.02 J1.17
  Bottom 0.203: v27.53,16.05 27.53,17.67 28.35,18.48 30.89,18.48 31.39,17.98 41.05,17.98 42.57,19.5 42.57,21.84 43.08,22.35 45.11,22.35 47.04,20.42 v47.04,20.02
FMU_I2C2_SDA  (via drill 0.3)
  Top 0.203: U9.43 27.63,9.44 27.74,9.54 27.74,15.13 27.43,15.44 v26.92,15.44 | v41.76,20.82 41.76,20.41 42.16,20.01 J1.18
  Bottom 0.203: v26.92,15.44 26.92,17.98 30.18,21.23 41.35,21.23 v41.76,20.82
FMU_I2C3_SCL  (via drill 0.3)
  Top 0.203: 48.63,11.98 J1.9 48.61,11.99 47.24,11.99 46.95,12.29 v45.82,12.29 44.81,13.3 44.81,16.65 44.5,16.96 41.66,16.96 41.25,17.37 40.23,17.37 39.62,17.98 37.49,17.98 37.15,17.64 U11.1 | v35.46,11.78 35.46,10.77 36.07,10.16 37.9,10.16 38.1,9.96 R10.1
  Bottom 0.203: v45.82,12.29 44.8,13.31 37.8,13.31 36.26,11.78 v35.46,11.78
FMU_I2C3_SDA  (via drill 0.3)
  Top 0.203: 45.01,11.99 v45.31,11.68 45.01,11.98 43.32,11.98 | 43.32,11.98 43.29,11.98 | 43.32,11.98 J1.10 43.24,12.08 42.27,12.08 41.86,12.49 41.86,16.15 41.05,16.96 39.07,16.96 U11.3 | R15.1 35.93,9.38 34.85,10.46 v34.85,11.17
  Bottom 0.203: v34.85,11.17 36.27,11.17 37.9,12.79 44.2,12.79 v45.31,11.68
FMU_UART5_RX  (via drill 0.3)
  Top 0.203: R9.2 27.8,17.12 27.8,16.8 v28.35,16.26 | v41.76,17.78 41.96,17.98 43.29,17.98 J1.16
  Bottom 0.203: v28.35,16.26 28.25,16.36 28.25,17.27 28.96,17.98 30.68,17.98 31.19,17.48 41.45,17.48 v41.76,17.78 42.97,18.99 J18.3
FMU_UART5_TX  (via drill 0.3)
  Top 0.203: J1.15 48.6,17.98 47.13,17.98 v47.04,17.88 | v28.96,16.76 28.85,16.76 28.45,17.16 28.45,19.5 27.84,20.11 26.38,20.11 R19.2
  Bottom 0.203: v28.96,16.76 28.96,17.06 29.36,17.47 30.38,17.47 30.79,17.06 41.95,17.06 42.57,17.68 44.08,17.68 J18.2 44.19,17.78 46.94,17.78 v47.04,17.88
FMU_USART2_CTS  (via drill 0.3)
  Top 0.203: J1.19 47.1,22.01 v47.04,21.95
  Bottom 0.203: v47.04,21.95 47.85,21.95 48.87,20.93 48.87,9.35 47.75,8.23 44.17,8.23 J20.4
FMU_USART2_RX  (via drill 0.3)
  Top 0.203: J1.22 44.88,24.01 v44.91,23.98
  Route15 0.203: v46.94,15.44 46.94,14.33 43.99,11.38 43.99,8.17 45.16,7 46.02,7 v46.13,7.11
  Bottom 0.203: v44.91,23.98 44.91,23.16 48.36,19.71 48.36,16.87 v46.94,15.44 | v46.13,7.11 46.02,7.01 J20.3
FMU_USART2_TX  (via drill 0.3)
  Top 0.203: J1.21 46.97,24.01 46.43,23.47 v46.43,22.55
  Bottom 0.203: v46.43,22.55 46.53,22.66 48.56,22.66 49.38,21.84 49.38,7.01 47.65,5.28 45.72,5.28 45.31,5.69 44.21,5.69 J20.2
GND  (via drill 0.3, 0.5)
  Top 0.254: U9.35 24.65,4.02 23.82,3.19 C9.2 | U3.2 35,33.37 v35.05,33.42 | U9.47 26.15,11.44 v25.81,11.78 | 35.56,27.5 v35.56,29.15 | C12.2 R18.1 R24.2 | U10.1 21.44,22.67 v21.44,22.65 | Q1.3 11.72,28.58 v11.89,28.75 | 42.8,6.01 42.24,6.01 42.27,5.99 v46.74,5.99 | v21.84,12.59 21.65,12.78 U9.8 | C8.2 26.92,14.52 26.72,14.72 v26.01,14.72 26.01,15.44 26.3,15.73 26.3,16.95 | 26.3,16.95 26.31,16.96 | U9.23 16.82,6.94 C10.2 | U11.2 38.1,16.25 37.69,15.84 37.29,15.84 36.78,15.33 v36.78,14.22 | R23.2 39.01,21.23 v39.62,21.84 | U5.2 31.19,26.82 v30.78,26.41 | 26.3,16.95 26.3,17.03 C5.2 | S1.B3 30.89,35.17 v30.89,35.15
  Top 0.305: U7.5 33.15,15.41 v32.61,15.94 | U7.8 31.83,10.99 J15.4
  Top 0.381: J1.3 47.88,6.01 | v46.94,29.05 47.9,30.01 J1.27 | v11.38,9.54 11.38,8.73 10.06,7.41 R13.1 9.71,6.95 9.71,6.9 9.55,6.9 8.65,6 C1.2 | v11.38,9.54 11.38,9.85 11.11,10.11 U2.22 | U6.2 12.5,8.43 v11.38,9.54 | U2.12 U2.11 | U4.2 19.98,19.91 20.02,19.86 R16.1 21.58,19.86 v21.64,19.8 22.15,19.3 22.15,18.69 X1.4 22.12,18.72 21.18,18.72 21.14,18.69 21.13,18.69 20.11,17.66 C6.1 18.64,17.66 C4.2 17.92,17.71 17.27,17.06 | U2.12 15.75,16.35 16.46,17.06 17.27,17.06 | U1.2 35.56,27.5 | R3.2 14.69,6.15 v15.34,6.8 15.94,7.4 C10.2 | U2.13 9.96,16.05 10.26,16.36 v10.26,16.65 | C9.2 22.97,2.83 v22.86,2.94 | v17.27,4.16 17.17,4.06 | v9.04,21.84 9.45,21.43 C2.2 R5.1 9.04,22.85 8.68,23.22 R2.2 | R22.1 17.21,17 17.27,17.06 | U5.2 31.19,28.55 30.89,28.85 28.89,28.85 | C5.2 24.52,17.12 X1.2 | v33.22,23.05 33.22,24.17 SSR1.2 | v29.36,23.05 29.16,23.26 29.16,24.2 SSR2.2 | U7.2 36.4,12.26 v36.07,12.59 | R18.1 40.45,27.42 J3.2
  Top 0.406: U2.12
  Top 0.508: R1.2 v28.96,11.98 | R20.1 28.89,28.85 R21.1 | Q2.2 31.36,33.46 30.89,33.93 v30.89,35.15
  Top 0.635: v45.92,9.24 45.01,8.32 45.01,6.09 44.91,5.99
  Top 1.016: C7.C 20.34,32.28 U8.2 | C11.C 23.59,26.31 v22.76,26.31 | J1.3 46.86,6.01 46.84,5.99 44.91,5.99 43.34,5.99 J1.4 42.8,6.01
  Route2 0.254: v36.78,14.22 36.78,14.11 | v39.62,21.84 39.73,21.84
  Bottom 0.254: J5.3 44.15,31.34 v45.11,32.3
  Bottom 0.381: J13.3 17.17,1.82 16.15,2.84 GND..P$1 17.17,4.06 v17.27,4.16 | v22.86,2.94 22.86,2.84
  Bottom 0.508: J20.5 45.66,9.5 v45.92,9.24 | J18.5 45.06,21.49 45.72,20.83 45.72,20.32 v46.33,19.71
  Bottom 1.016: GND.1 2.34,29.35 3.35,28.34 8.23,28.34 J10.2
  pour Route2 (isolate 0.254): 49.17,0.2 49.78,0.81 49.78,35.34 49.28,35.85 0.71,35.85 0.2,35.34 0.2,0.61 0.61,0.2
JTCK-SWCLK  (via drill 0.3)
  Top 0.203: v27.33,4.16 27.03,4.46 27.03,6.31 U9.37 27.87,6.44 v28.04,6.6
  Bottom 0.203: v27.33,4.16 28.45,4.16 J12.4 | JTCK-SWCLK.P$1 v28.03,6.6 v28.04,6.6
JTDI
  Top 0.203: U9.38 26.25,6.94 26.01,6.7 26.01,4.36 27.05,3.32 J12.8
  Bottom 0.203: JTDI.P$1 26.87,3.6 26.87,3.19 J12.8
JTDO  (via drill 0.3)
  Top 0.203: U9.39 28.17,7.44 v28.35,7.61 28.96,7 28.96,4.27 28.32,3.63 J12.6
  Bottom 0.203: v28.35,7.61 27.64,8.32 27.64,8.78 JTDO.P$1
JTMS-SWDIO  (via drill 0.3)
  Top 0.203: v24.99,7.32 v24.99,5.78 24.27,5.78 24.18,5.69 24.18,4.71 U9.34
  Bottom 0.203: v24.99,5.78 25.3,5.78 25.9,5.18 28.69,5.18 J12.2 | JTMS-SWDIO.P$1 24.44,7.87 v24.99,7.32
LED1
  Top 0.203: U9.27 20.65,3.98 20.52,3.85 18.27,3.85 R8.1
LED2
  Top 0.203: U9.28 21.15,3.87 20.73,3.45 19.69,3.45 R12.1
LED3  (via drill 0.3)
  Top 0.203: v12.6,15.94 12.6,10.86 v12.9,10.56 | v19,8.83 19,8.22 18.71,7.94 U9.21 | R11.2 8.68,24.92 9.25,25.49 9.25,26.41 v9.45,26.61
  Route15 0.203: v12.6,15.94 12.6,18.28 11.07,19.8 11.07,23.26 9.45,24.88 v9.45,26.61
  Bottom 0.203: v12.9,10.56 12.9,10.15 14.63,8.43 18.59,8.43 v19,8.83
N$1
  Top 0.203: SSR2.1 31.73,24.81 32.21,25.29 R7.2
N$2
  Top 0.203: SSR1.1 35.81,24.43 36.37,24.99 36.37,25.64 R6.2
N$3  (via drill 0.3)
  Top 0.203: U6.4 11.47,5.49 11.07,5.88 v11.07,7
  Route15 0.203: v11.07,7 11.07,7.1 8.94,9.24 8.94,16.76 9.45,17.26 9.45,18.28 8.94,18.79 8.94,20.41 7.72,21.63 7.72,21.84 4.98,24.58 4.98,33.47 J14.1
N$4
  Top 0.635: U5.1 30.24,27.38 30.07,27.22 29.12,27.22 L12.1
N$5
  Top 0.203: U9.6 22.65,16.05 22.25,16.45 22.25,16.89 X1.1 22.17,16.77
  Top 0.381: C6.2 21.55,16.36 X1.1
N$6
  Top 0.203: U9.5 23.15,16.03 23.27,16.15 23.27,17.77 23.67,18.18 23.87,18.18 X1.3 24.62,18.42
  Top 0.381: 24.62,18.42 C5.1
N$7
  Top 0.203: L2.1 9.92,24.4 R4.2
N$8
  Top 0.203: LED1.C 16,1.58 R8.2
N$9
  Top 0.406: R16.2 23.05,21.16 U8.4
N$10
  Top 0.203: R11.1 7.38,24.52 7.15,24.52 6.5,23.87 5.49,23.87 4.98,24.38 4.98,24.78 4.57,25.19 4.57,27.02 4.88,27.32 J17.2
N$11  (via drill 0.3)
  Top 0.203: U11.5 37.15,20.38 37.39,20.62 37.39,21.16 R23.1 37.49,21.27 v37.49,23.05
  Bottom 0.203: v37.49,23.05 37.34,23.05 WRITE_ENABLE.P$1
N$12  (via drill 0.3)
  Top 0.254: 30.18,32.49 Q2.3
  Top 0.381: R25.2 27.64,32.11 v27.64,30.68
  Top 0.508: v27.64,30.68 28.96,30.68 30.18,31.9 30.18,32.49
  Bottom 0.254: 28.19,30.13 J22.2
  Bottom 0.508: v27.64,30.68 28.19,30.13
N$14
  Top 0.635: F1.2 32.31,8.03 L4.1
N$15  (via drill 0.3)
  Top 0.203: R17.2 45.98,34.09 v45.62,33.72
  Bottom 0.254: J5.2 45.11,29.86 45.41,30.17 45.41,31.69 45.82,32.1 45.82,33.52 v45.62,33.72
N$21  (via drill 0.5)
  Top 0.635: v32.11,20.41 31.73,20.03 SSR2.4
  Bottom 0.635: v32.11,20.41 32.21,20.52 40.25,20.52 J8.1
N$22  (via drill 0.5)
  Top 0.635: v29.57,19.5 29.57,18.79 29.18,18.41 SSR2.3
  Bottom 0.635: v29.57,19.5 39.22,19.5 39.73,18.99 40.52,18.99 J8.2
N$23  (via drill 0.5)
  Top 0.635: SSR1.3 33.83,17.36 v33.83,16.15
  Bottom 0.635: v33.83,16.15 34.95,15.03 40.22,15.03 J6.2
N$24  (via drill 0.5)
  Top 0.635: v35.76,16.15 35.76,17.87 SSR1.4
  Bottom 0.635: J6.1 35.95,15.96 v35.76,16.15
N$27
  Top 0.203: J9.3 39.91,8.61 38.61,7.31 37.4,7.31 R15.2
N$28
  Top 0.203: R10.2 38.66,8.08 39.12,8.53 39.12,9.35 39.62,9.86 J9.2
N$29  (via drill 0.5)
  Top 0.254: U1.1 34.54,27.56
  Top 0.635: 34.54,27.56 v34.54,28.85
  Bottom 0.635: v34.54,28.85 36.26,27.14 38.8,27.14 40.54,25.39 J2.1
N$30  (via drill 0.5)
  Top 0.635: v33.53,30.78 33.53,30.99 34.04,31.5 34.04,31.69 34.03,31.7 34.03,31.89 U3.1
  Bottom 0.635: J3.1 39.71,28.76 37.07,31.4 34.15,31.4 v33.53,30.78
N$31
  Top 0.203: LED2.C 14.12,1.31 14.33,1.31 14.83,0.81 16.15,0.81 16.46,1.12 17.27,1.12 R12.2
N$38
  Top 0.203: LED4.C 12.09,2.29 12.09,4.16 10.06,6.19 R13.2
N$43
  Top 0.203: 31.05,14.38 30.99,14.32 J15.2 31.14,14.18 34.38,14.18 34.65,13.91 34.65,12.59 34.24,12.18 33.22,12.18 U7.7
  Top 0.381: R14.1 29.37,15.22 30.18,14.42 30.9,14.42 J15.2
N$44
  Top 0.203: J15.3 31,13.1 31.6,13.1 32.18,13.68 32.99,13.68 U7.6
  Top 0.381: R14.2 29.55,13.92 30.38,13.1 30.97,13.1 J15.3
N$47  (via drill 0.3)
  Top 0.305: L4.2 31.56,9.38 29.77,11.17 29.77,12.39 v29.26,12.89
  Bottom 0.305: v29.26,12.89 29.26,14.32 30.48,15.54 30.94,15.54
  Bottom 0.381: 30.94,15.54 J15.1
NRST  (via drill 0.3)
  Top 0.203: U9.7 22.15,14.72 21.44,15.44 19.36,15.44 v19.23,15.57 | S1.A1 27.62,33.72 v27.53,33.63
  Top 0.381: v19.23,15.57 19.1,15.44 18.59,15.94 C4.1
  Bottom 0.203: v19.23,15.57 19.54,15.57 !RESET.P$1 20.93,17.37 20.93,21.13 24.69,24.89 24.69,30.79 25.6,31.7 26.92,31.7 27.53,32.31 v27.53,33.63
PB2-BOOT1
  Top 0.203: R3.1 15.05,8.12 16.87,8.12 17.18,8.44 U9.20
PPM1
  Top 0.203: U2.14 9.87,15.23 9.45,15.23 8.23,16.45 8.23,17.16 7.62,17.77 7.62,20.16 J16.22
PPM2
  Top 0.203: U2.15 9.89,14.72 9.25,14.72 7.72,16.25 7.72,16.96 6.25,18.43 J16.19
PPM3
  Top 0.203: U2.16 8.74,14.01 6.71,16.05 6.66,16.05 J16.16
PPM4
  Top 0.203: U2.17 9.89,13.3 8.33,13.3 7.72,13.91 J16.13
PPM5
  Top 0.203: U2.18 9.93,12.69 8.84,12.69 7.52,11.37 J16.10
PPM6
  Top 0.203: U2.19 9.87,11.98 8.94,11.98 5.79,8.83 J16.7
PPM7
  Top 0.203: U2.20 9.91,11.37 9.25,11.37 8.13,10.25 8.13,8.83 6.25,6.95 J16.4
PPM8
  Top 0.203: U2.21 9.35,10.76 8.84,10.25 8.84,8.93 7.62,7.71 7.62,5.12 J16.1 | U2.21
PPM_INPUT  (via drill 0.3)
  Top 0.203: J1.23 47.25,26 46.94,26.31 v46.94,27.64 | U9.29 21.64,5.28 21.13,5.78 21.13,6.9 v21.64,7.41 21.64,10.76 22.66,11.78 v22.66,12.59 | U6.1 13.15,8.16 v13.21,8.22 | v31.9,16.45 31.5,16.45 30.89,17.06 30.89,21.63 v31.29,22.04
  Route15 0.203: v13.21,8.22 13.21,7.82 11.68,6.29 9.35,6.29 7.52,4.46 7.52,2.48 J4.1
  Bottom 0.203: v13.21,8.22 14.02,7.41 v21.64,7.41 | v22.66,12.59 22.96,12.89 26.82,12.89 30.38,16.45 v31.9,16.45 | v31.29,22.04 31.7,22.45 41.35,22.45 41.76,22.85 41.76,26.62 42.77,27.64 v46.94,27.64
RELAY1  (via drill 0.3)
  Top 0.203: U9.33 23.67,4.71 23.67,10.05 v23.88,10.25 | v35.97,13.51 35.97,14.42 35.05,15.33 35.05,24.18 34.85,24.38 34.85,25.84 R6.1 34.86,25.77 35.07,25.56 35.05,25.56
  Bottom 0.203: v23.88,10.25 24.38,10.76 26.21,10.76 26.62,10.36 32.82,10.36 v35.97,13.51
RELAY2  (via drill 0.3)
  Top 0.203: U9.32 23.15,12.07 v23.37,12.29 | v35.36,14.11 34.65,14.83 34.65,23.97 34.14,24.48 34.14,25.3 33.64,25.8 33.56,25.8 R7.1
  Bottom 0.203: v23.37,12.29 23.57,12.49 26.11,12.49 27.74,10.86 32.11,10.86 v35.36,14.11
SAFETY  (via drill 0.3)
  Top 0.203: U9.41 25.41,8.44 v25.4,8.43 | v11.89,10.56 v11.89,16.45 | v8.23,22.24 7.38,23.1 R2.1 5.18,23.26 4.37,24.07 4.37,24.58 3.66,25.29 3.66,28.14 4.17,28.64 5.79,28.64 5.99,28.64
  Top 0.381: J17.3 5.86,28.57 5.79,28.64
  Route15 0.203: v11.89,16.45 11.89,18.08 8.23,21.73 v8.23,22.24
  Bottom 0.203: v11.89,10.56 14.43,8.02 22.65,8.02 23.37,8.74 25.09,8.74 v25.4,8.43
SERVO_OC_DETECT  (via drill 0.3)
  Top 0.203: U4.3 17.92,20.86 17.68,20.62 17.68,18.38 17.07,17.77 16.05,17.77 14.53,16.25 14.53,11.88 13.82,11.17 v13.82,10.86 | v21.03,8.93 20.15,8.05 U9.26
  Bottom 0.203: v13.82,10.86 14.94,10.86 15.14,10.66 19.1,10.66 19.1,10.67 20.84,8.93 v21.03,8.93
SERVO_PWR_EN  (via drill 0.3)
  Top 0.203: 23.67,13.69 U9.4 23.65,14.81 v23.77,14.93 | v16.05,21.73 16.05,20.88 U4.4 | v13.31,14.72 v13.31,16.76 | R22.2 17.41,15.7 17.45,15.74 17.48,15.74
  Top 0.381: v18.09,15.13 17.48,15.74
  Route15 0.203: v13.31,16.76 13.31,18.08 16.05,20.82 v16.05,21.73
  Bottom 0.203: v23.77,14.93 23.57,14.72 18.59,14.72 18.19,14.32 18.09,14.32 | v13.31,14.72 13.72,14.32 18.09,14.32 | 18.09,14.32 v18.09,15.13
USART1_RX  (via drill 0.3)
  Top 0.203: J13.2 21.03,2.33 22.65,3.95 U9.31 22.65,6.29 v22.55,6.39 22.55,8.23 22.25,8.53 v22.25,8.64
  Bottom 0.203: v22.55,6.39 25.32,6.39 26.01,5.71 J7.1 | USART1_RX.P$1 18.69,4.78 19.41,4.06 21.03,2.43 J13.2 | U$7.1 22.94,9.02 22.55,8.64 v22.25,8.64
USART1_TX  (via drill 0.3)
  Top 0.203: U9.30 22.15,5.78 v21.74,6.19 | U6.3 11.85,7.86 v11.68,8.02
  Bottom 0.203: v21.74,6.19 21.74,5.83 USART1_TX.P$1 | J13.1 22.28,2.3 21.23,3.35 USART1_TX.P$1 | USART1_TX.P$1 21.23,4.16 19.2,6.19 13.51,6.19 v11.68,8.02
USART2_RX  (via drill 0.3)
  Top 0.203: U9.13 17.9,13.32 v17.98,13.4 | R19.1 25.34,21.88 25.09,21.63 25.09,19.91 25.5,19.5 26.21,19.5 v26.31,19.4
  Bottom 0.203: v17.98,13.4 18.8,14.22 23.98,14.22 25.6,15.84 25.6,18.69 26.11,19.19 26.11,19.3 | 26.11,19.3 26.11,22.95 26.52,23.36 J21.3 | v26.31,19.4 26.21,19.4 26.11,19.3
USART2_TX  (via drill 0.3)
  Top 0.203: U9.12 19.18,13.69 v19,13.51 | R9.1 27.64,19.19 v27.43,19.4
  Bottom 0.203: v19,13.51 19.3,13.81 24.18,13.81 26.11,15.74 26.11,18.08 v27.43,19.4 28.65,20.62 28.65,24.07 28.13,24.59 27.45,24.59 J21.2
USART3_RX
  Top 0.203: U9.22 18.57,7.44 18.9,7.1 18.9,5.78 17.88,4.77 13.46,4.77 13.15,5.08 U6.6
VDD_3V3  (via drill 0.3, 0.5)
  Top 0.254: 24.79,3.35 25.15,3.71 U9.36 | U9.1 25.17,13.71 25.6,13.71 v25.81,13.51 | U9.48 26.77,11.94 26.31,12.39 26.01,12.39 25.81,12.59 v25.81,13.51 | v25.81,13.51 26.01,13.71 26.38,13.71 C8.1 | v21.03,12.59 21.15,12.71 U9.9 | U9.24 16.7,6.44 C10.1 | J17.1 6.47,26.07 7.21,26.81 7.21,29.06 8.12,29.96 v8.74,29.96
  Top 0.381: C9.1 24.29,1.53 v24.79,2.02 24.79,3.35 | 14.43,3.08 LED2.A LED4.A 12.8,4.56 12.5,4.87 U6.5 | 14.43,3.08 LED1.A 15.44,3.04 | U2.1 U2.2 14.55,9.46 v14.53,9.44 | v14.73,3.95 14.73,3.38 14.43,3.08 | U11.4 39.05,19.03 38.61,18.59 v38.1,18.59 | U7.3 37.01,13.53 v36.78,13.3
  Top 0.406: v17.27,5.48 16.98,5.48 C10.1
  Top 0.813: U10.2 v21.74,24.99
  Top 1.016: v21.74,24.99 23.49,24.99 C11.A
  Bottom 0.254: VDD_3V3.P$1 14.63,4.06 v14.73,3.95
  Bottom 0.381: v13.51,27.42 13.51,28.34 12.29,29.56 12.29,29.57 11.89,29.97 8.75,29.97 v8.74,29.96
  other vias: 15.14,24.99 14.33,27.42 15.85,27.12 15.14,25.8 15.14,26.61 15.14,23.36 15.85,23.77 15.85,24.58 15.85,25.39 15.85,26.2 15.85,22.95 15.14,27.42 15.14,24.17
  pour Route15 (isolate 0.305): 10.97,30.68 10.77,0.2 38.1,0.2 38.1,30.98
  pour Top (no thermals): 12.09,23.56 12.09,27.32 12.5,27.73 15.85,27.73 16.26,27.32 16.26,22.95 15.95,22.65 15.14,22.65 14.63,23.16 12.5,23.16
VDD_5V  (via drill 0.3, 0.5)
  Top 0.254: L3.1 42.67,34.7 v42.67,33.62 | U5.4 31.2,30.11 v31.2,30.17
  Top 0.305: 34.48,29.86 34.48,30.07 U1.5
  Top 0.381: U1.5 34.54,30.13 | v46.94,3.95 46.99,4.01 | 34.05,33.53 34.05,33.43 v34.04,33.42 | U5.5 30.24,30.16
  Top 0.635: 34.05,33.53 U3.5 | J1.2 43.28,3.97 | D1.CATHODE 14.33,18.69 14.6,18.96 U4.5 | v33.53,29.86 34.48,29.86 | F1.1 32.31,1.82 33.53,0.6 35.46,0.6 36.47,1.62 36.47,3.95 38.41,5.88 40.74,5.88 42.57,4.06 46.18,4.06 46.23,4.01 | 31.2,30.11 U5.5
  Top 0.813: v17.37,22.45 17.37,26.51 18.16,27.3 U10.3 21.82,27.3 23.06,28.54 23.3,28.54 D2.CATHODE | 14.33,18.69 14.53,18.48 v14.83,18.48
  Top 1.016: J1.2 46.23,4.01 46.99,4.01 J1.1 | D2.CATHODE 25.81,29.87 26.2,30.27 v26.2,30.37 v26.21,30.37
  Route15 0.254: v46.94,3.95 46.84,3.95 | v42.67,33.62 42.06,33.01 42.06,30.47
  Route15 0.635: v34.04,33.42 34.04,32.31 34.34,32 34.25,32 34.24,32 | 34.54,32 34.54,29.86 v33.53,29.86 31.51,29.86 v31.2,30.17
  Route15 0.813: v14.83,18.48 17.37,21.02 v17.37,22.45
  Route15 1.016: v46.94,3.95 47.55,3.95 48.87,5.28 48.87,23.97 42.37,30.47 42.06,30.47 37.29,30.47 35.76,32 34.54,32 34.24,32 26.93,32 26.92,32 26.21,31.29 v26.21,30.37
VDD_5V_ANALOG  (via drill 0.3)
  Top 0.254: L3.2 43.93,33.68 v43.99,33.62
  Bottom 0.254: v43.99,33.62 42.67,32.3 42.67,29.05 43.08,28.64 44.12,28.64 J5.1
VDD_SERVO  (via drill 0.3, 0.5)
  Top 0.254: 11.18,18.08 10.99,18.26 11.07,18.35 11.07,18.38
  Top 0.381: U2.23 U2.24 9.87,8.73 9.86,8.73 9.25,8.12 v9.14,8.12 8.48,7.46 C1.1 | v11.18,10.86 11.18,18.08 | U4.1 18.69,18.99
  Top 0.508: v20.02,18.79 19.81,18.99 18.69,18.99 18.3,18.99
  Top 0.762: 11.07,18.38 11.21,18.52 L1.2
  Top 0.813: v10.4,17.67 10.36,17.67
  Top 0.889: D1.ANODE 11.39,18.66 10.99,18.26 v10.4,17.67
  Bottom 0.381: v9.14,8.12 9.14,8.43 11.18,10.46 v11.18,10.86
  Bottom 0.635: v20.02,18.79 19.3,19.5 11.99,19.5 10.4,17.91 v10.4,17.67
VDD_SERVO_EXT  (via drill 0.5)
  Top 0.254: J16.20 3.76,18.99
  Top 0.61: v8.74,17.87 9.9,19.04 L1.1
  Top 1.016: J16.5 J16.2 3.66,3.7 | J16.5 J16.8 J16.11 J16.14 J16.17 J16.20 J16.23 | 3.66,3.7 3.66,3.65 | 3.66,3.7 3.66,6.24 J16.5
  Route15 0.254: 8.03,19.4 7.16,20.26 3.71,20.26 | 8.03,17.72 3.71,17.72 | 8.03,15.18 3.66,15.18 | 8.03,12.64 3.66,12.64 | 8.03,10.1 3.71,10.1 | 8.03,8.22 7.37,7.56 3.66,7.56
  Route15 0.635: v8.74,17.87 8.13,17.87 8.03,17.77 | 8.03,17.77 8.03,17.72 8.03,15.18 8.03,12.64 8.03,10.1 8.03,8.22 | 8.03,19.4 8.03,17.77
  Route15 1.016: J14.2 J16.23 3.71,20.26 J16.5 | J16.2 J16.5 | J16.2 3.71,3.7 3.66,3.65 3.66,6.24 | 3.66,6.24 3.66,11.37 | J16.5 3.66,6.24 | J16.2 3.66,3.7
  Bottom 0.254: 8.03,8.22 7.37,7.56 3.71,7.56 | 8.03,17.72 3.71,17.72 | 8.03,15.18 3.66,15.18 | 8.03,12.64 3.66,12.64 | 8.03,10.1 3.71,10.1 | 8.03,19.4 7.16,20.26 3.71,20.26
  Bottom 0.61: 8.03,17.67 8.03,17.72
  Bottom 0.635: v8.74,17.87 8.13,17.87 8.03,17.77 8.03,17.67 8.03,15.18 8.03,12.64 8.03,10.1 8.03,8.22 | 8.03,17.72 8.03,19.4
  Bottom 1.016: J4.2 J16.2 | 3.66,3.65 3.66,6.24 J16.5
  Bottom 1.27: 3.66,3.65 3.66,21.53
VIN  (via drill 0.3, 0.5)
  Top 0.254: L2.2 9.86,25.7 10.46,26.31 v10.46,26.61
  Top 0.381: R25.1 28.89,32.47 v28.25,33.12
  Top 0.635: 13.65,30.13 13.41,30.37
  Top 0.762: Q1.4 13.57,30.05 C7.A
  Top 0.813: v24.59,33.01 24.62,32.98 D3.CATHODE
  Top 1.016: U8.1 14,32.69 C7.A 13.65,30.13 13.49,29.96
  Route15 0.254: v10.46,26.61 10.46,30.17 14.17,33.88 U8.1
  Bottom 0.381: v28.25,33.12 28.35,33.12 29.16,33.93
  Bottom 0.508: J22.1 29.76,33.33 29.16,33.93 27.94,35.15 25.2,35.15 24.59,34.54 v24.59,33.01
  Bottom 0.813: U8.1 17.37,31.69 23.37,31.69 24.59,32.91 v24.59,33.01
VIN_CONTACT
  Top 0.635: 8.23,26.51 8.23,26.52
  Top 0.762: J10.1 8.23,26.51
  Bottom 1.016: J10.1 8.23,26.31 3.86,26.31 6-18V.1
  pour Top (no thermals): 7.62,26.92 9.55,30.47 11.07,30.47 11.07,27.22 9.35,26.41 8.74,25.8 7.62,25.8
VOUT
  Top 0.813: D2.ANODE D3.ANODE 22.72,33.46 U8.3

### Text on the board
tPlace: RESET | SAFETY | ON | ERR | ACT | MULTI
bPlace: ALARM | ADC IN | ADC5 | CURR | SW1 | + | IO UART2 | 5V | - | SW2 | + | POWER IN | - | R1 | 40V/1A | x | x | R2 | x | UART5 | x | CAN2 | SPI | SERVOS | I2C1 | PX4IO v1.3 | IO | UART1 | USART2
tDocu: S1 | S8
bDocu: RST